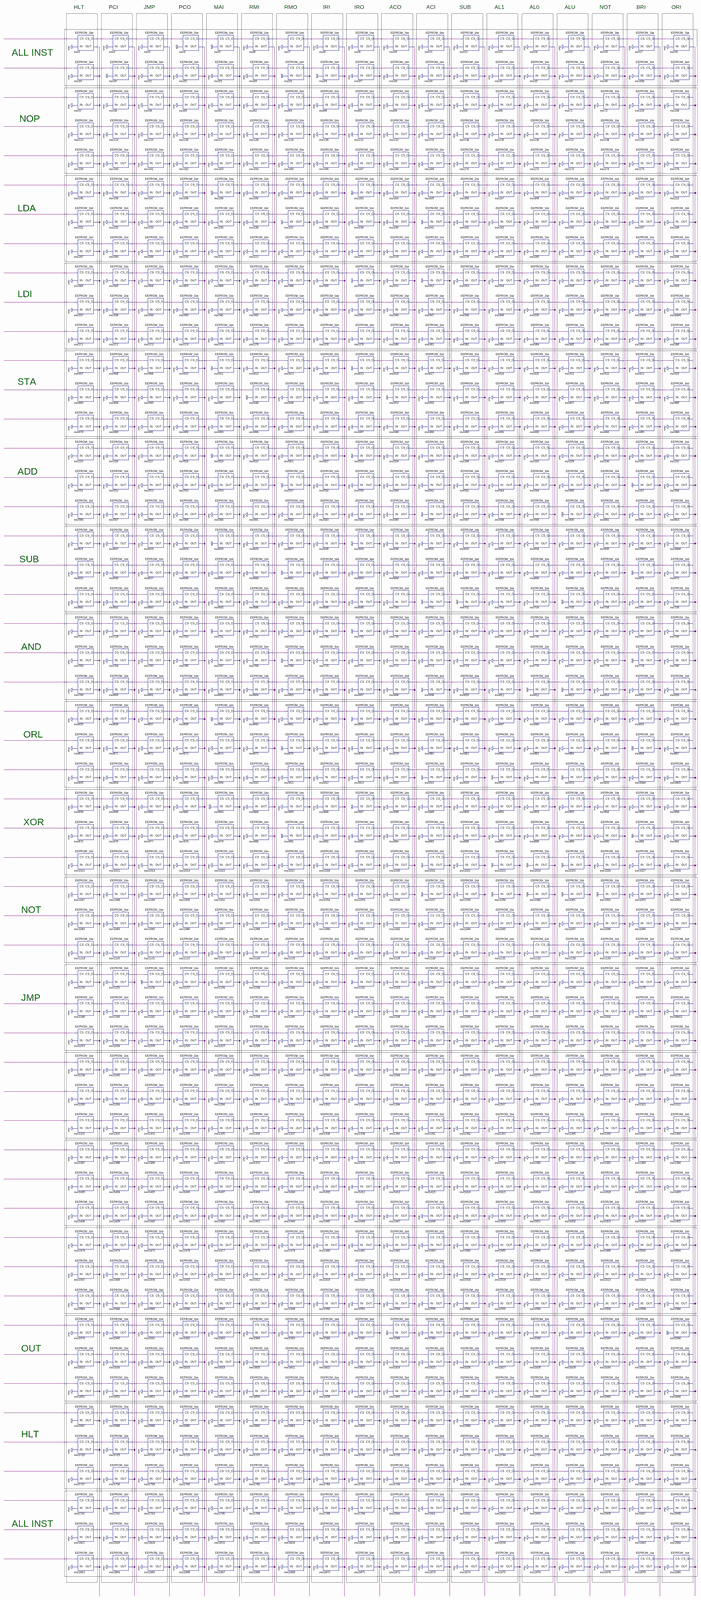
[diagram p0: schematic sheet, whole]
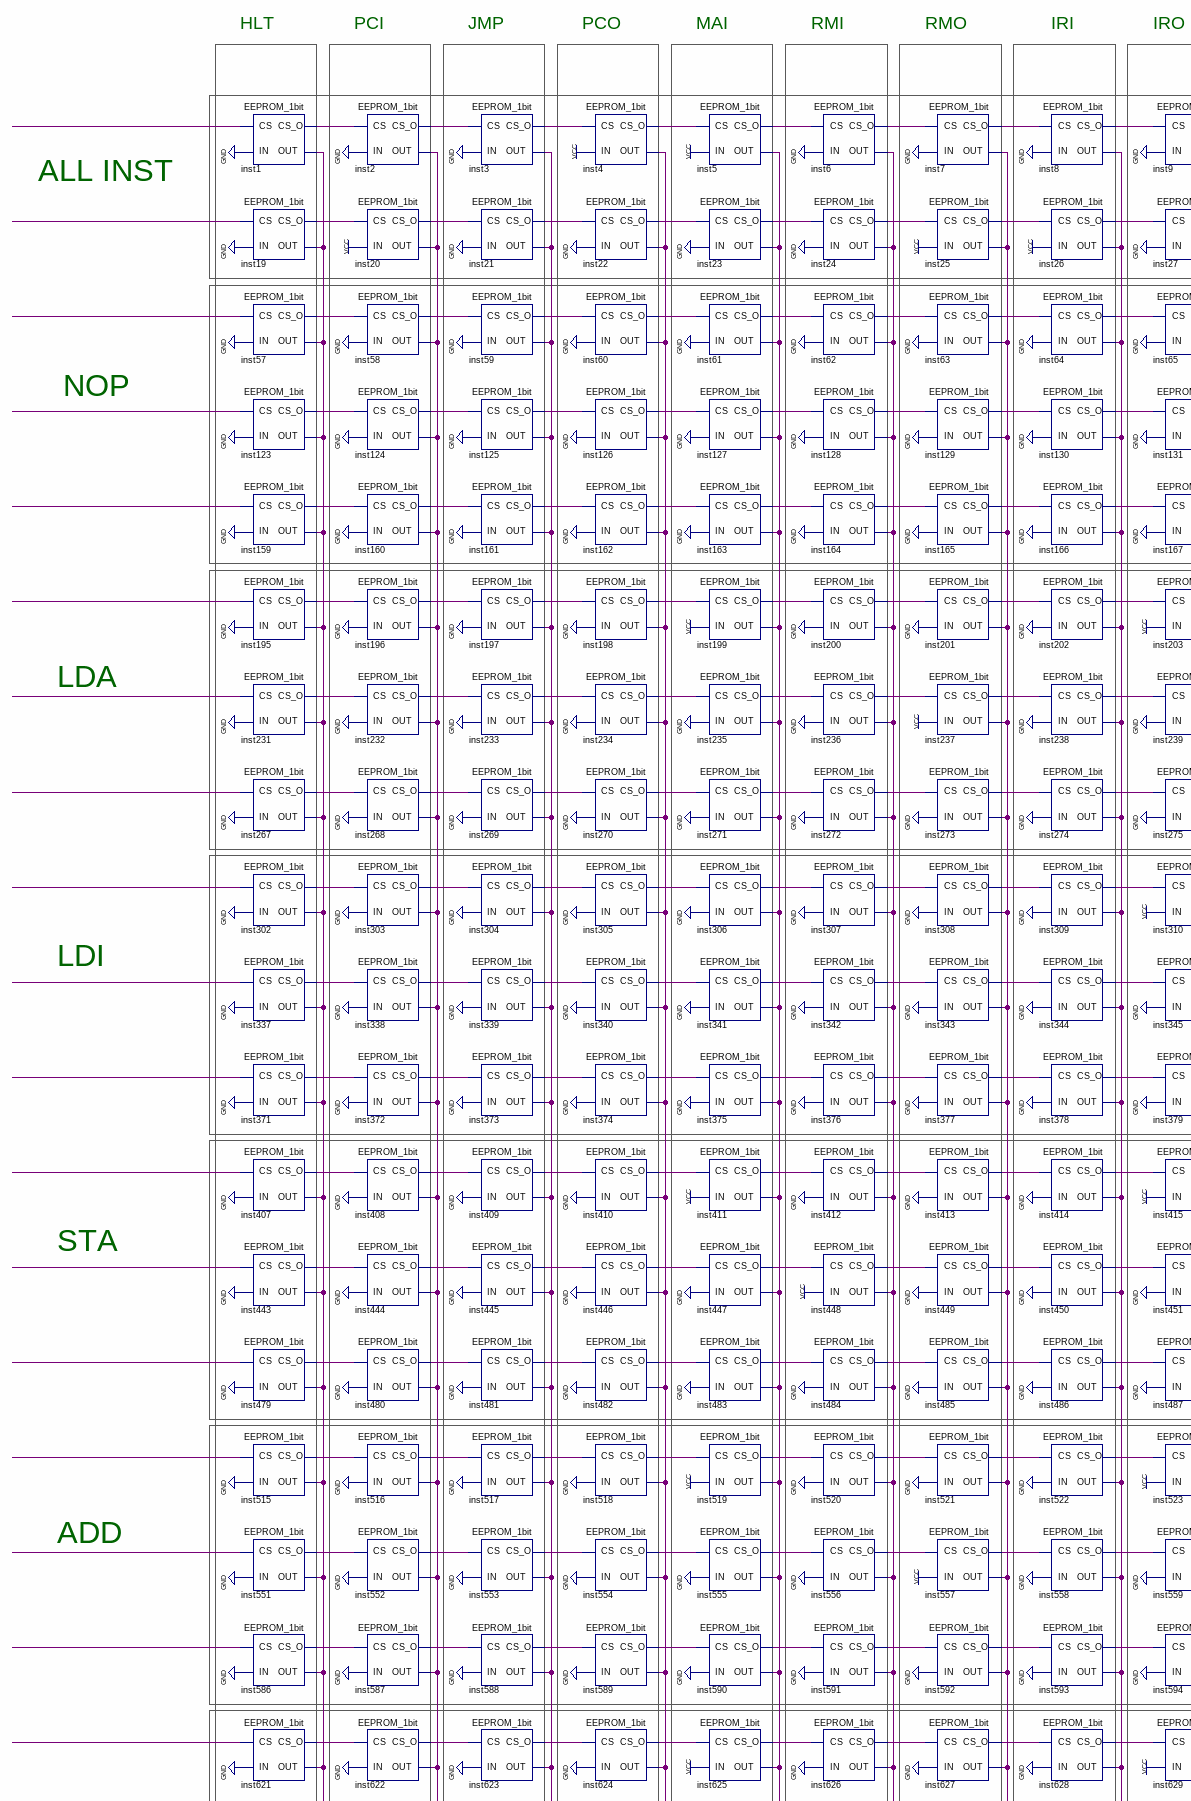
[diagram p1: schematic sheet, upper left part]
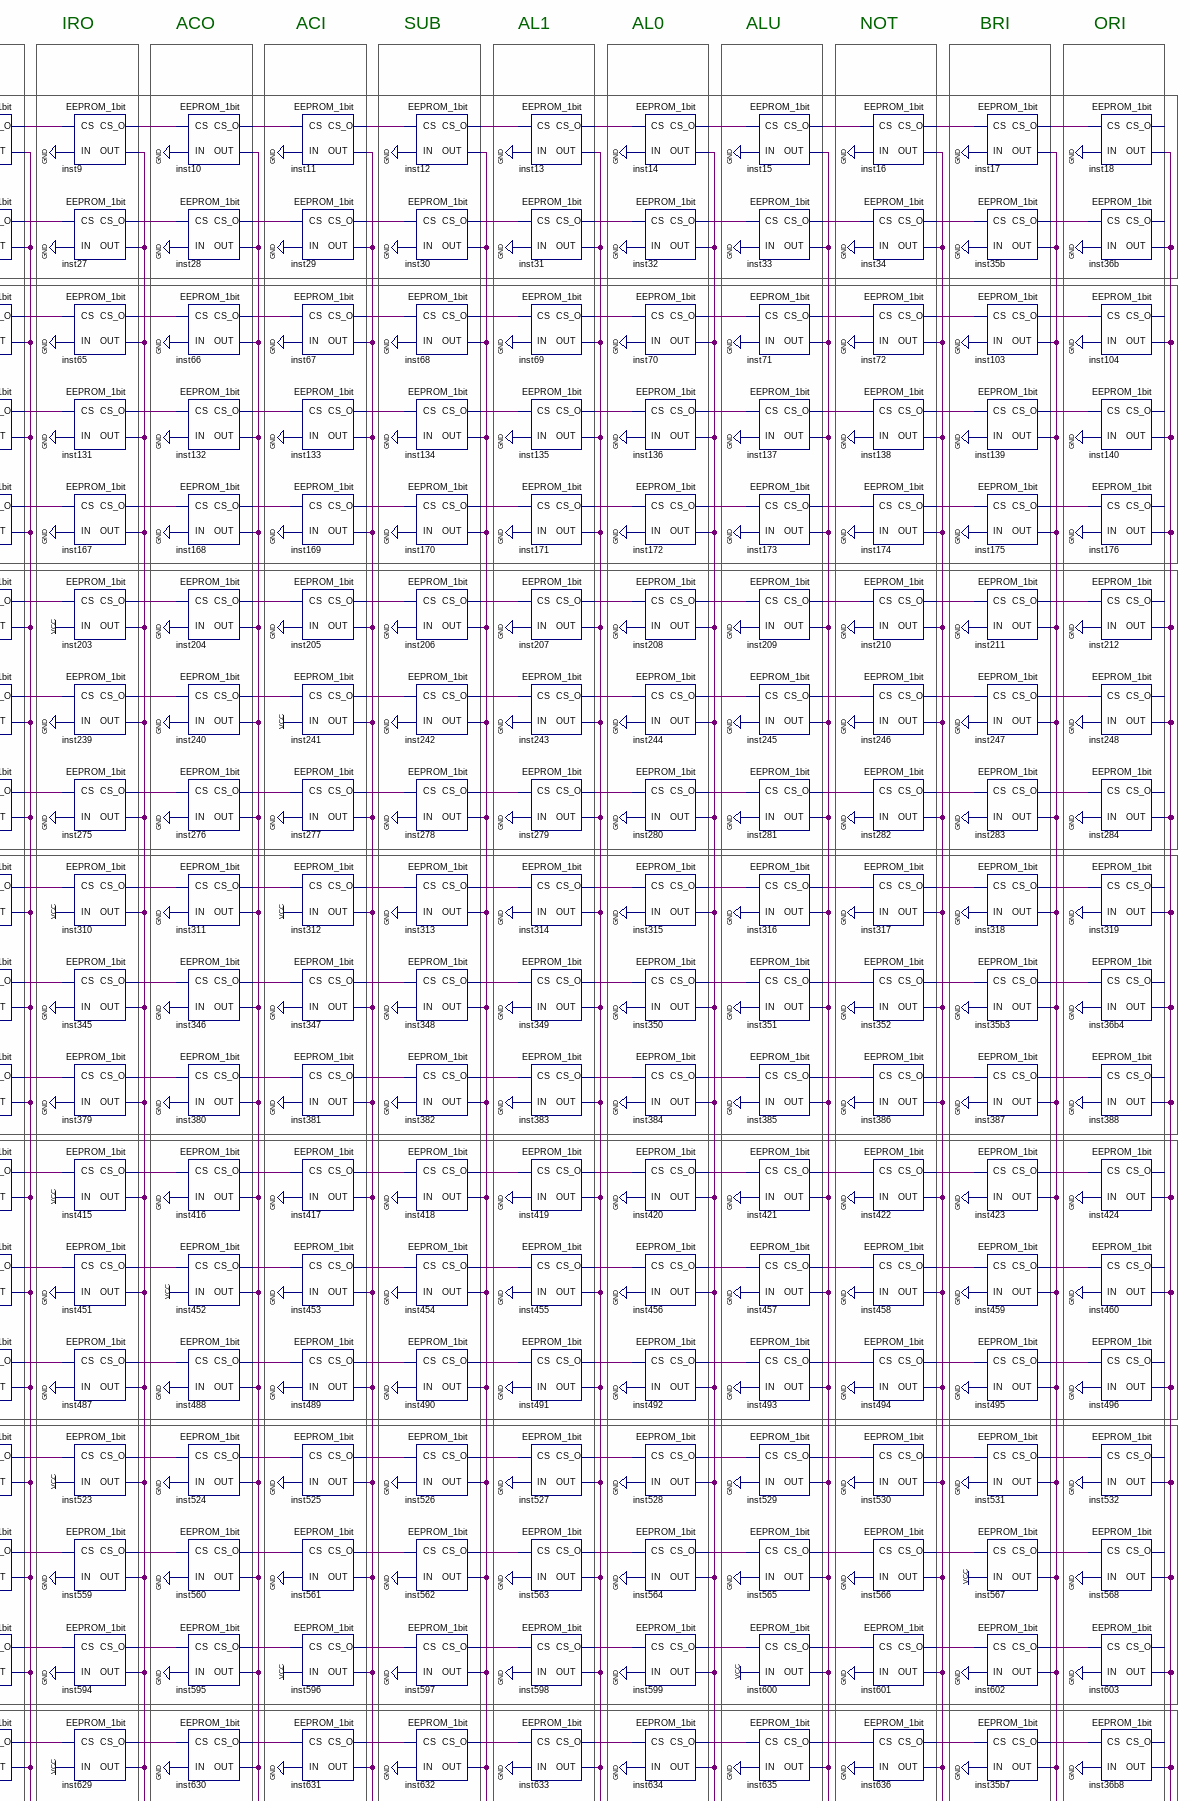
[diagram p2: schematic sheet, upper right part]
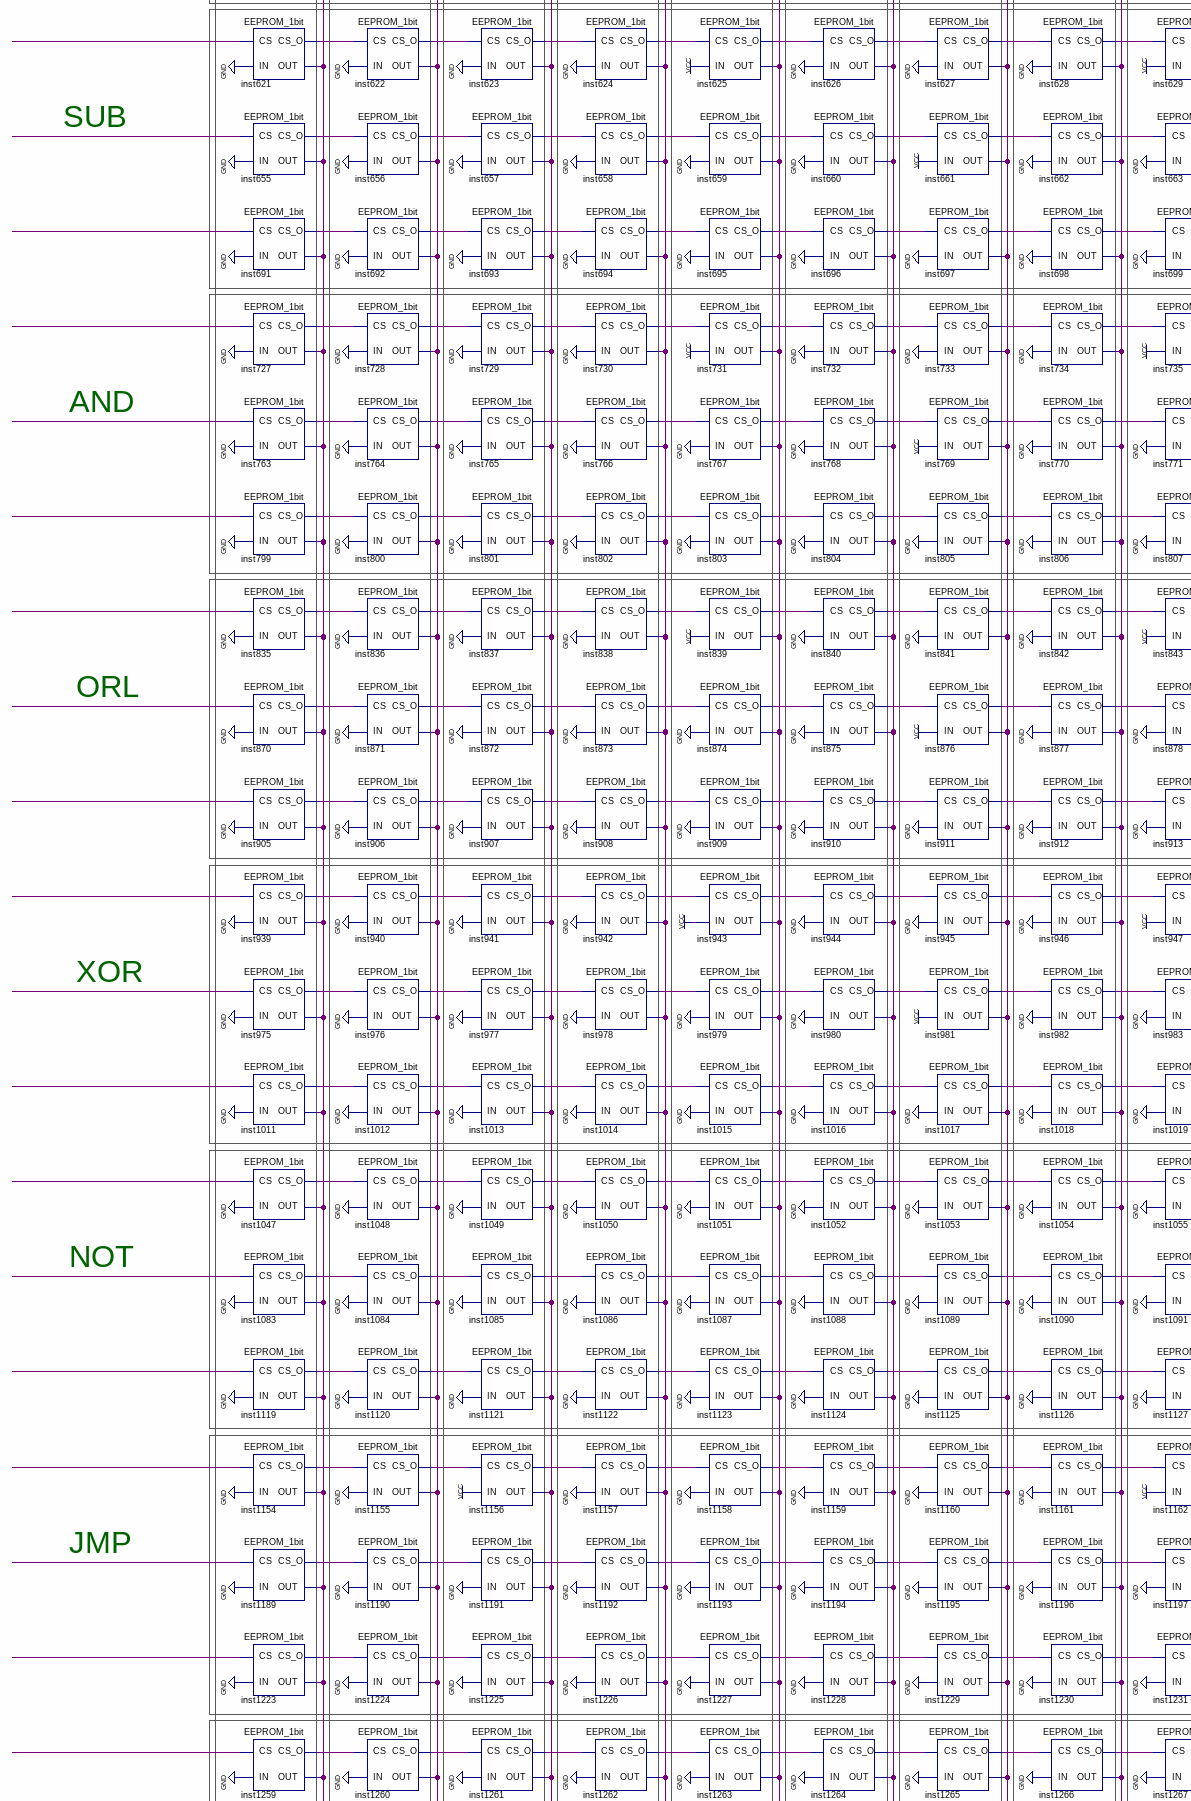
[diagram p3: schematic sheet, middle left part]
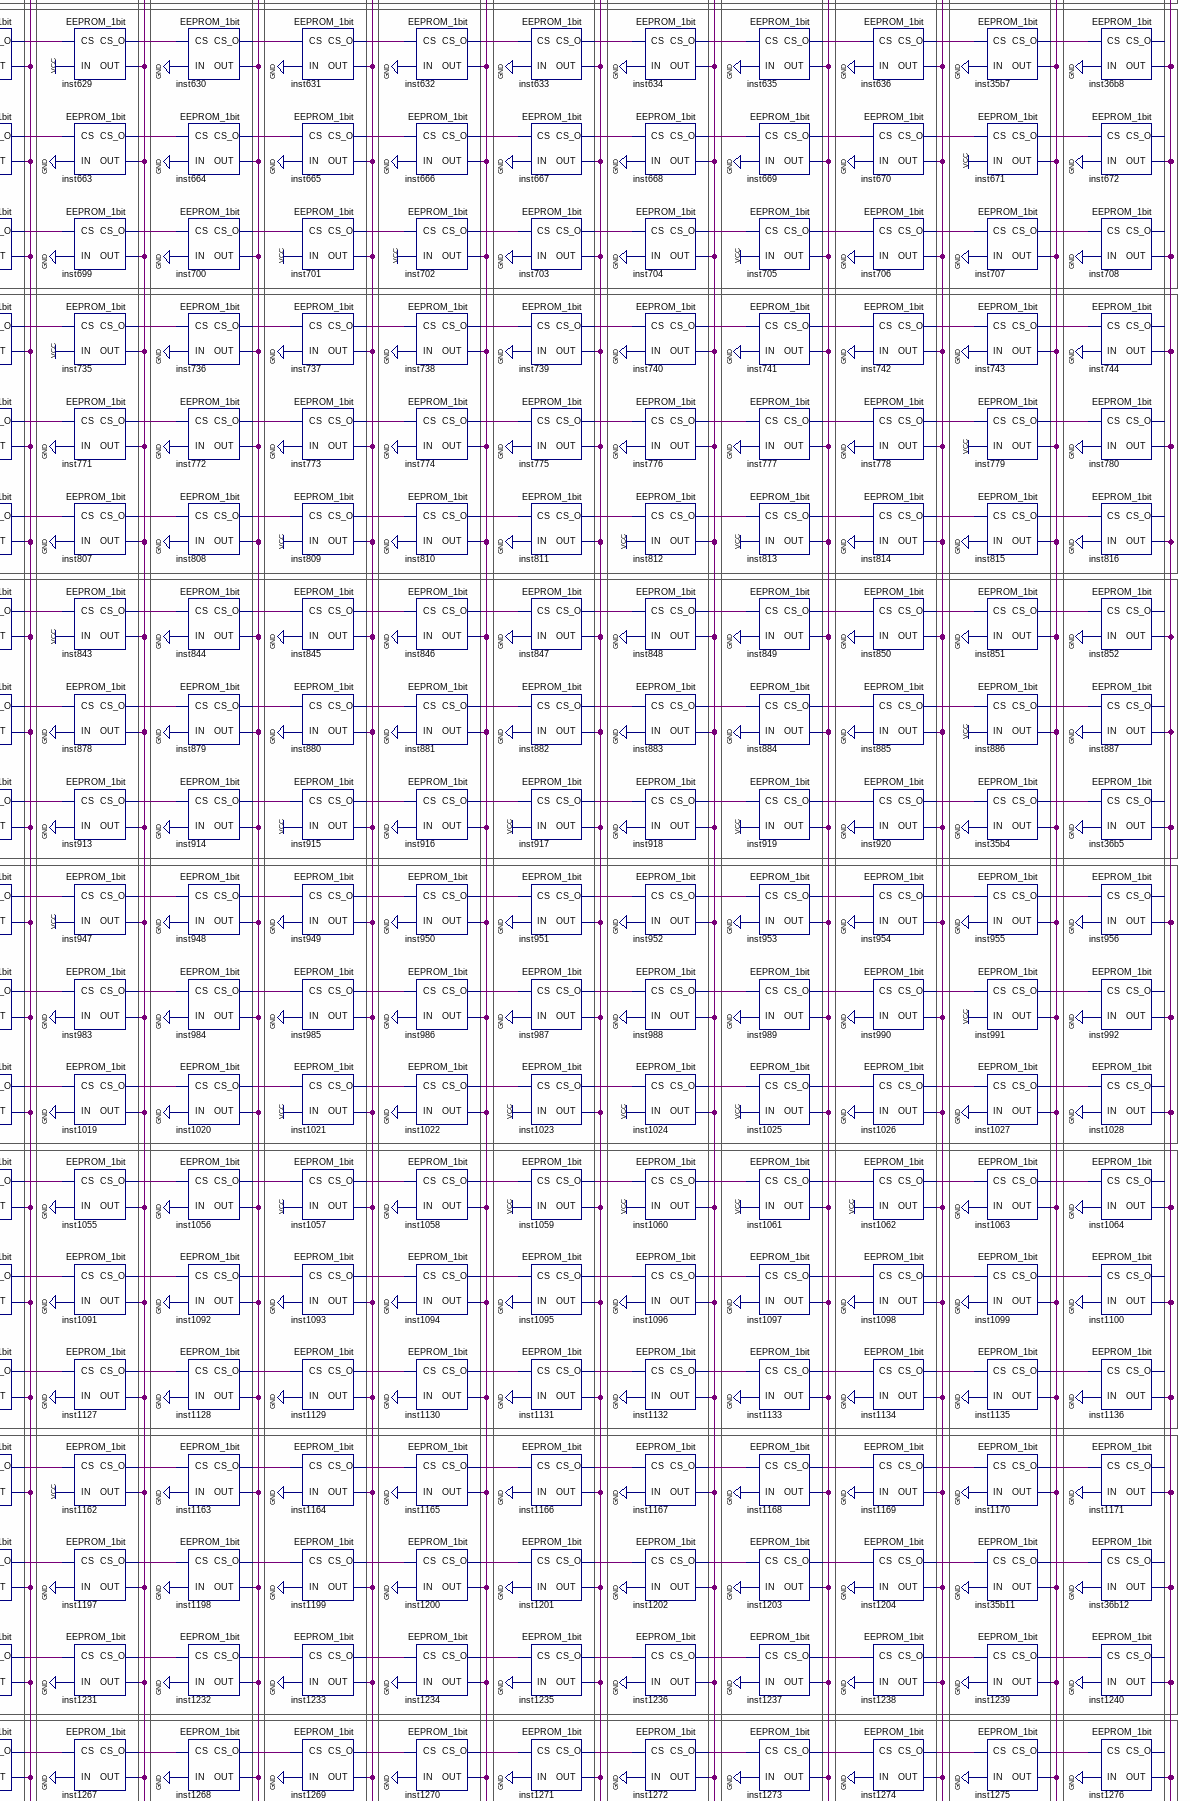
[diagram p4: schematic sheet, middle right part]
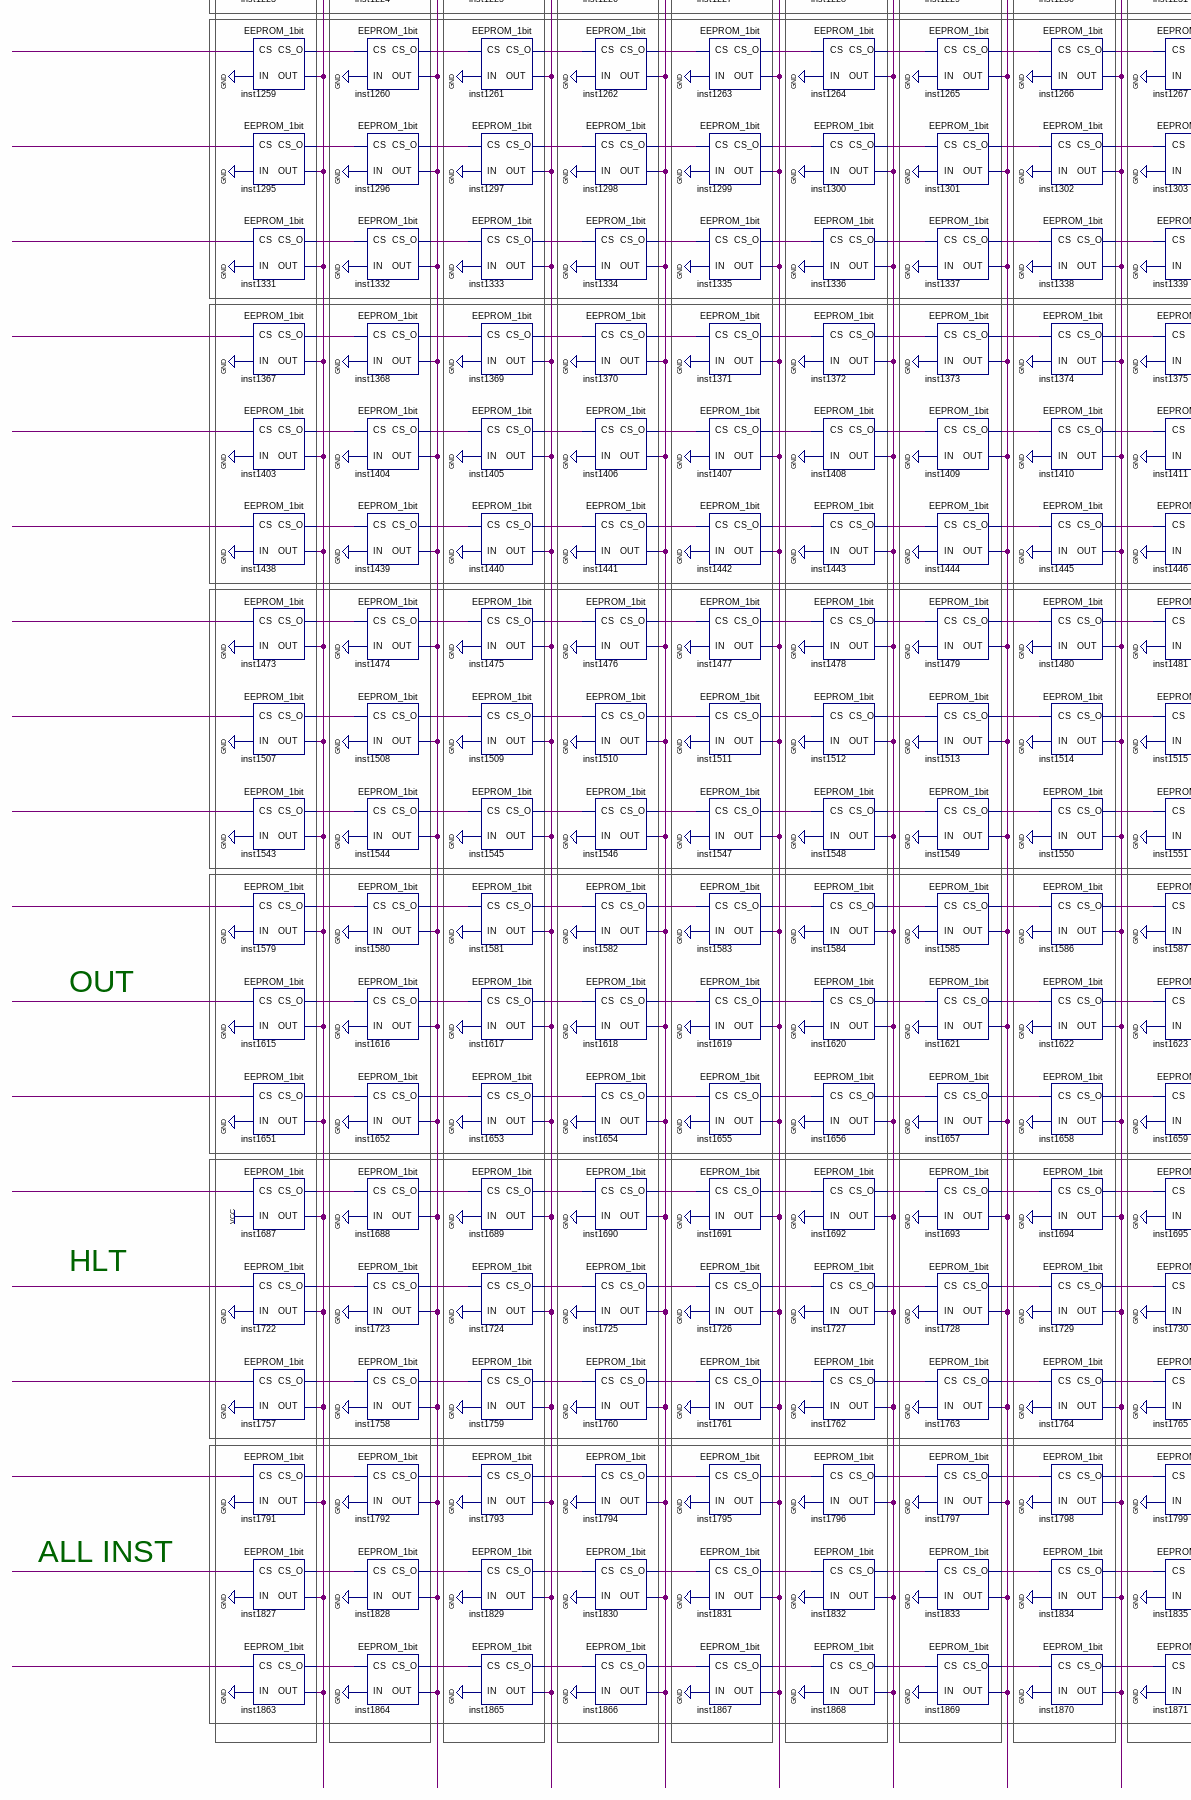
[diagram p5: schematic sheet, lower left part]
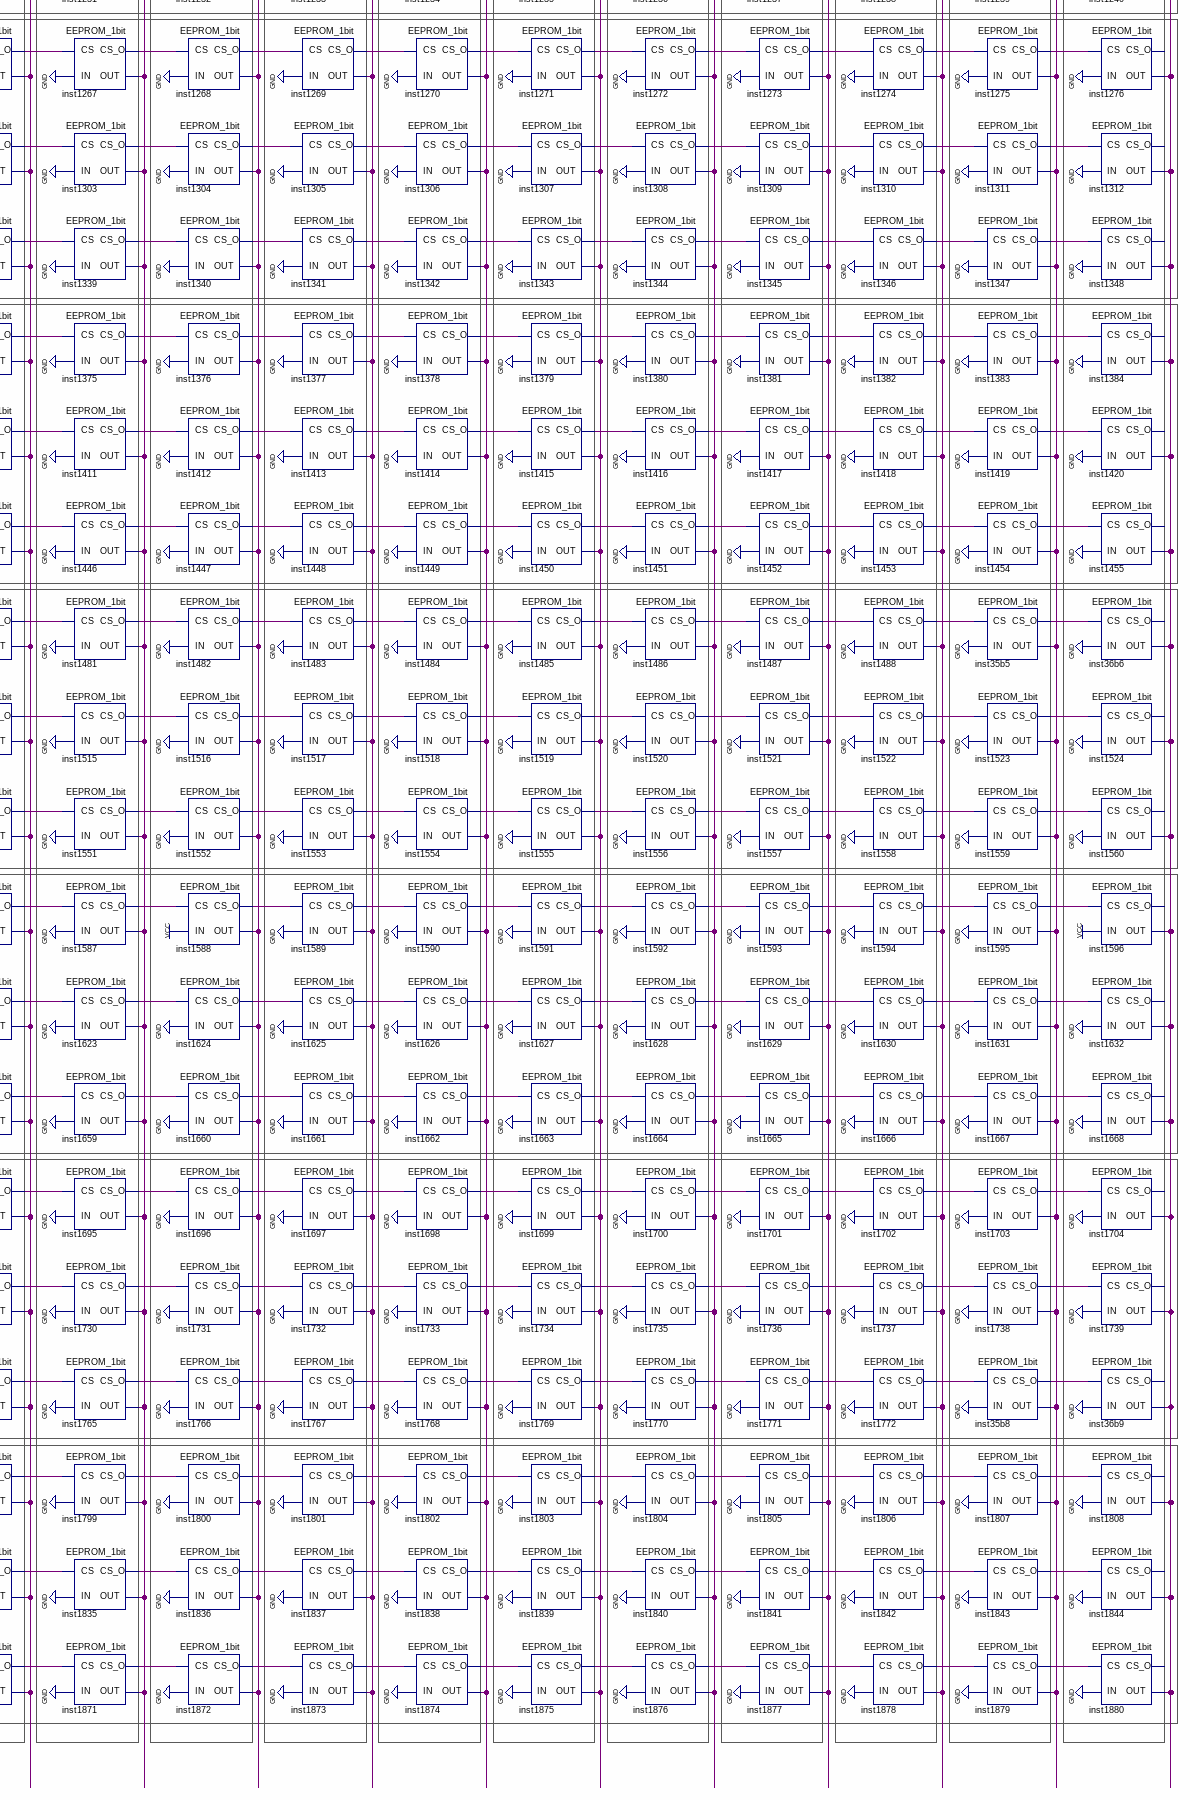
[diagram p6: schematic sheet, lower right part]
// Quartus schematic EEPROM_53x18_EMPTY.bdf as structural Verilog: 954 symbols, 0 pins
module EEPROM_53x18_EMPTY (
);

  wire inst1_cs_o, inst1_out, inst2_cs_o, inst2_out, inst3_cs_o, inst3_out, inst4_cs_o, inst4_out,
       inst5_cs_o, inst5_out, inst6_cs_o, inst6_out, inst7_cs_o, inst7_out, inst8_cs_o, inst8_out,
       inst9_cs_o, inst9_out, inst10_cs_o, inst10_out, inst11_cs_o, inst11_out, inst12_cs_o, inst12_out,
       inst13_cs_o, inst13_out, inst14_cs_o, inst14_out, inst15_cs_o, inst15_out, inst16_cs_o, inst16_out,
       inst17_cs_o, inst17_out, inst18_out, inst19_cs_o, inst20_cs_o, inst21_cs_o, inst22_cs_o, inst23_cs_o,
       inst24_cs_o, inst25_cs_o, inst26_cs_o, inst27_cs_o, inst28_cs_o, inst29_cs_o, inst30_cs_o,
       inst31_cs_o, inst32_cs_o, inst33_cs_o, inst34_cs_o, inst35b3_cs_o, inst35b4_cs_o, inst35b5_cs_o,
       inst35b7_cs_o, inst35b8_cs_o, inst35b11_cs_o, inst35b_cs_o, inst57_cs_o, inst58_cs_o, inst59_cs_o,
       inst60_cs_o, inst61_cs_o, inst62_cs_o, inst63_cs_o, inst64_cs_o, inst65_cs_o, inst66_cs_o,
       inst67_cs_o, inst68_cs_o, inst69_cs_o, inst70_cs_o, inst71_cs_o, inst72_cs_o, inst103_cs_o,
       inst123_cs_o, inst124_cs_o, inst125_cs_o, inst126_cs_o, inst127_cs_o, inst128_cs_o, inst129_cs_o,
       inst130_cs_o, inst131_cs_o, inst132_cs_o, inst133_cs_o, inst134_cs_o, inst135_cs_o, inst136_cs_o,
       inst137_cs_o, inst138_cs_o, inst139_cs_o, inst159_cs_o, inst160_cs_o, inst161_cs_o, inst162_cs_o,
       inst163_cs_o, inst164_cs_o, inst165_cs_o, inst166_cs_o, inst167_cs_o, inst168_cs_o, inst169_cs_o,
       inst170_cs_o, inst171_cs_o, inst172_cs_o, inst173_cs_o, inst174_cs_o, inst175_cs_o, inst195_cs_o,
       inst196_cs_o, inst197_cs_o, inst198_cs_o, inst199_cs_o, inst200_cs_o, inst201_cs_o, inst202_cs_o,
       inst203_cs_o, inst204_cs_o, inst205_cs_o, inst206_cs_o, inst207_cs_o, inst208_cs_o, inst209_cs_o,
       inst210_cs_o, inst211_cs_o, inst231_cs_o, inst232_cs_o, inst233_cs_o, inst234_cs_o, inst235_cs_o,
       inst236_cs_o, inst237_cs_o, inst238_cs_o, inst239_cs_o, inst240_cs_o, inst241_cs_o, inst242_cs_o,
       inst243_cs_o, inst244_cs_o, inst245_cs_o, inst246_cs_o, inst247_cs_o, inst267_cs_o, inst268_cs_o,
       inst269_cs_o, inst270_cs_o, inst271_cs_o, inst272_cs_o, inst273_cs_o, inst274_cs_o, inst275_cs_o,
       inst276_cs_o, inst277_cs_o, inst278_cs_o, inst279_cs_o, inst280_cs_o, inst281_cs_o, inst282_cs_o,
       inst283_cs_o, inst302_cs_o, inst303_cs_o, inst304_cs_o, inst305_cs_o, inst306_cs_o, inst307_cs_o,
       inst308_cs_o, inst309_cs_o, inst310_cs_o, inst311_cs_o, inst312_cs_o, inst313_cs_o, inst314_cs_o,
       inst315_cs_o, inst316_cs_o, inst317_cs_o, inst318_cs_o, inst337_cs_o, inst338_cs_o, inst339_cs_o,
       inst340_cs_o, inst341_cs_o, inst342_cs_o, inst343_cs_o, inst344_cs_o, inst345_cs_o, inst346_cs_o,
       inst347_cs_o, inst348_cs_o, inst349_cs_o, inst350_cs_o, inst351_cs_o, inst352_cs_o, inst371_cs_o,
       inst372_cs_o, inst373_cs_o, inst374_cs_o, inst375_cs_o, inst376_cs_o, inst377_cs_o, inst378_cs_o,
       inst379_cs_o, inst380_cs_o, inst381_cs_o, inst382_cs_o, inst383_cs_o, inst384_cs_o, inst385_cs_o,
       inst386_cs_o, inst387_cs_o, inst407_cs_o, inst408_cs_o, inst409_cs_o, inst410_cs_o, inst411_cs_o,
       inst412_cs_o, inst413_cs_o, inst414_cs_o, inst415_cs_o, inst416_cs_o, inst417_cs_o, inst418_cs_o,
       inst419_cs_o, inst420_cs_o, inst421_cs_o, inst422_cs_o, inst423_cs_o, inst443_cs_o, inst444_cs_o,
       inst445_cs_o, inst446_cs_o, inst447_cs_o, inst448_cs_o, inst449_cs_o, inst450_cs_o, inst451_cs_o,
       inst452_cs_o, inst453_cs_o, inst454_cs_o, inst455_cs_o, inst456_cs_o, inst457_cs_o, inst458_cs_o,
       inst459_cs_o, inst479_cs_o, inst480_cs_o, inst481_cs_o, inst482_cs_o, inst483_cs_o, inst484_cs_o,
       inst485_cs_o, inst486_cs_o, inst487_cs_o, inst488_cs_o, inst489_cs_o, inst490_cs_o, inst491_cs_o,
       inst492_cs_o, inst493_cs_o, inst494_cs_o, inst495_cs_o, inst515_cs_o, inst516_cs_o, inst517_cs_o,
       inst518_cs_o, inst519_cs_o, inst520_cs_o, inst521_cs_o, inst522_cs_o, inst523_cs_o, inst524_cs_o,
       inst525_cs_o, inst526_cs_o, inst527_cs_o, inst528_cs_o, inst529_cs_o, inst530_cs_o, inst531_cs_o,
       inst551_cs_o, inst552_cs_o, inst553_cs_o, inst554_cs_o, inst555_cs_o, inst556_cs_o, inst557_cs_o,
       inst558_cs_o, inst559_cs_o, inst560_cs_o, inst561_cs_o, inst562_cs_o, inst563_cs_o, inst564_cs_o,
       inst565_cs_o, inst566_cs_o, inst567_cs_o, inst586_cs_o, inst587_cs_o, inst588_cs_o, inst589_cs_o,
       inst590_cs_o, inst591_cs_o, inst592_cs_o, inst593_cs_o, inst594_cs_o, inst595_cs_o, inst596_cs_o,
       inst597_cs_o, inst598_cs_o, inst599_cs_o, inst600_cs_o, inst601_cs_o, inst602_cs_o, inst621_cs_o,
       inst622_cs_o, inst623_cs_o, inst624_cs_o, inst625_cs_o, inst626_cs_o, inst627_cs_o, inst628_cs_o,
       inst629_cs_o, inst630_cs_o, inst631_cs_o, inst632_cs_o, inst633_cs_o, inst634_cs_o, inst635_cs_o,
       inst636_cs_o, inst655_cs_o, inst656_cs_o, inst657_cs_o, inst658_cs_o, inst659_cs_o, inst660_cs_o,
       inst661_cs_o, inst662_cs_o, inst663_cs_o, inst664_cs_o, inst665_cs_o, inst666_cs_o, inst667_cs_o,
       inst668_cs_o, inst669_cs_o, inst670_cs_o, inst671_cs_o, inst691_cs_o, inst692_cs_o, inst693_cs_o,
       inst694_cs_o, inst695_cs_o, inst696_cs_o, inst697_cs_o, inst698_cs_o, inst699_cs_o, inst700_cs_o,
       inst701_cs_o, inst702_cs_o, inst703_cs_o, inst704_cs_o, inst705_cs_o, inst706_cs_o, inst707_cs_o,
       inst727_cs_o, inst728_cs_o, inst729_cs_o, inst730_cs_o, inst731_cs_o, inst732_cs_o, inst733_cs_o,
       inst734_cs_o, inst735_cs_o, inst736_cs_o, inst737_cs_o, inst738_cs_o, inst739_cs_o, inst740_cs_o,
       inst741_cs_o, inst742_cs_o, inst743_cs_o, inst763_cs_o, inst764_cs_o, inst765_cs_o, inst766_cs_o,
       inst767_cs_o, inst768_cs_o, inst769_cs_o, inst770_cs_o, inst771_cs_o, inst772_cs_o, inst773_cs_o,
       inst774_cs_o, inst775_cs_o, inst776_cs_o, inst777_cs_o, inst778_cs_o, inst779_cs_o, inst799_cs_o,
       inst800_cs_o, inst801_cs_o, inst802_cs_o, inst803_cs_o, inst804_cs_o, inst805_cs_o, inst806_cs_o,
       inst807_cs_o, inst808_cs_o, inst809_cs_o, inst810_cs_o, inst811_cs_o, inst812_cs_o, inst813_cs_o,
       inst814_cs_o, inst815_cs_o, inst835_cs_o, inst836_cs_o, inst837_cs_o, inst838_cs_o, inst839_cs_o,
       inst840_cs_o, inst841_cs_o, inst842_cs_o, inst843_cs_o, inst844_cs_o, inst845_cs_o, inst846_cs_o,
       inst847_cs_o, inst848_cs_o, inst849_cs_o, inst850_cs_o, inst851_cs_o, inst870_cs_o, inst871_cs_o,
       inst872_cs_o, inst873_cs_o, inst874_cs_o, inst875_cs_o, inst876_cs_o, inst877_cs_o, inst878_cs_o,
       inst879_cs_o, inst880_cs_o, inst881_cs_o, inst882_cs_o, inst883_cs_o, inst884_cs_o, inst885_cs_o,
       inst886_cs_o, inst905_cs_o, inst906_cs_o, inst907_cs_o, inst908_cs_o, inst909_cs_o, inst910_cs_o,
       inst911_cs_o, inst912_cs_o, inst913_cs_o, inst914_cs_o, inst915_cs_o, inst916_cs_o, inst917_cs_o,
       inst918_cs_o, inst919_cs_o, inst920_cs_o, inst939_cs_o, inst940_cs_o, inst941_cs_o, inst942_cs_o,
       inst943_cs_o, inst944_cs_o, inst945_cs_o, inst946_cs_o, inst947_cs_o, inst948_cs_o, inst949_cs_o,
       inst950_cs_o, inst951_cs_o, inst952_cs_o, inst953_cs_o, inst954_cs_o, inst955_cs_o, inst975_cs_o,
       inst976_cs_o, inst977_cs_o, inst978_cs_o, inst979_cs_o, inst980_cs_o, inst981_cs_o, inst982_cs_o,
       inst983_cs_o, inst984_cs_o, inst985_cs_o, inst986_cs_o, inst987_cs_o, inst988_cs_o, inst989_cs_o,
       inst990_cs_o, inst991_cs_o, inst1011_cs_o, inst1012_cs_o, inst1013_cs_o, inst1014_cs_o, inst1015_cs_o,
       inst1016_cs_o, inst1017_cs_o, inst1018_cs_o, inst1019_cs_o, inst1020_cs_o, inst1021_cs_o,
       inst1022_cs_o, inst1023_cs_o, inst1024_cs_o, inst1025_cs_o, inst1026_cs_o, inst1027_cs_o,
       inst1047_cs_o, inst1048_cs_o, inst1049_cs_o, inst1050_cs_o, inst1051_cs_o, inst1052_cs_o,
       inst1053_cs_o, inst1054_cs_o, inst1055_cs_o, inst1056_cs_o, inst1057_cs_o, inst1058_cs_o,
       inst1059_cs_o, inst1060_cs_o, inst1061_cs_o, inst1062_cs_o, inst1063_cs_o, inst1083_cs_o,
       inst1084_cs_o, inst1085_cs_o, inst1086_cs_o, inst1087_cs_o, inst1088_cs_o, inst1089_cs_o,
       inst1090_cs_o, inst1091_cs_o, inst1092_cs_o, inst1093_cs_o, inst1094_cs_o, inst1095_cs_o,
       inst1096_cs_o, inst1097_cs_o, inst1098_cs_o, inst1099_cs_o, inst1119_cs_o, inst1120_cs_o,
       inst1121_cs_o, inst1122_cs_o, inst1123_cs_o, inst1124_cs_o, inst1125_cs_o, inst1126_cs_o,
       inst1127_cs_o, inst1128_cs_o, inst1129_cs_o, inst1130_cs_o, inst1131_cs_o, inst1132_cs_o,
       inst1133_cs_o, inst1134_cs_o, inst1135_cs_o, inst1154_cs_o, inst1155_cs_o, inst1156_cs_o,
       inst1157_cs_o, inst1158_cs_o, inst1159_cs_o, inst1160_cs_o, inst1161_cs_o, inst1162_cs_o,
       inst1163_cs_o, inst1164_cs_o, inst1165_cs_o, inst1166_cs_o, inst1167_cs_o, inst1168_cs_o,
       inst1169_cs_o, inst1170_cs_o, inst1189_cs_o, inst1190_cs_o, inst1191_cs_o, inst1192_cs_o,
       inst1193_cs_o, inst1194_cs_o, inst1195_cs_o, inst1196_cs_o, inst1197_cs_o, inst1198_cs_o,
       inst1199_cs_o, inst1200_cs_o, inst1201_cs_o, inst1202_cs_o, inst1203_cs_o, inst1204_cs_o,
       inst1223_cs_o, inst1224_cs_o, inst1225_cs_o, inst1226_cs_o, inst1227_cs_o, inst1228_cs_o,
       inst1229_cs_o, inst1230_cs_o, inst1231_cs_o, inst1232_cs_o, inst1233_cs_o, inst1234_cs_o,
       inst1235_cs_o, inst1236_cs_o, inst1237_cs_o, inst1238_cs_o, inst1239_cs_o, inst1259_cs_o,
       inst1260_cs_o, inst1261_cs_o, inst1262_cs_o, inst1263_cs_o, inst1264_cs_o, inst1265_cs_o,
       inst1266_cs_o, inst1267_cs_o, inst1268_cs_o, inst1269_cs_o, inst1270_cs_o, inst1271_cs_o,
       inst1272_cs_o, inst1273_cs_o, inst1274_cs_o, inst1275_cs_o, inst1295_cs_o, inst1296_cs_o,
       inst1297_cs_o, inst1298_cs_o, inst1299_cs_o, inst1300_cs_o, inst1301_cs_o, inst1302_cs_o,
       inst1303_cs_o, inst1304_cs_o, inst1305_cs_o, inst1306_cs_o, inst1307_cs_o, inst1308_cs_o,
       inst1309_cs_o, inst1310_cs_o, inst1311_cs_o, inst1331_cs_o, inst1332_cs_o, inst1333_cs_o,
       inst1334_cs_o, inst1335_cs_o, inst1336_cs_o, inst1337_cs_o, inst1338_cs_o, inst1339_cs_o,
       inst1340_cs_o, inst1341_cs_o, inst1342_cs_o, inst1343_cs_o, inst1344_cs_o, inst1345_cs_o,
       inst1346_cs_o, inst1347_cs_o, inst1367_cs_o, inst1368_cs_o, inst1369_cs_o, inst1370_cs_o,
       inst1371_cs_o, inst1372_cs_o, inst1373_cs_o, inst1374_cs_o, inst1375_cs_o, inst1376_cs_o,
       inst1377_cs_o, inst1378_cs_o, inst1379_cs_o, inst1380_cs_o, inst1381_cs_o, inst1382_cs_o,
       inst1383_cs_o, inst1403_cs_o, inst1404_cs_o, inst1405_cs_o, inst1406_cs_o, inst1407_cs_o,
       inst1408_cs_o, inst1409_cs_o, inst1410_cs_o, inst1411_cs_o, inst1412_cs_o, inst1413_cs_o,
       inst1414_cs_o, inst1415_cs_o, inst1416_cs_o, inst1417_cs_o, inst1418_cs_o, inst1419_cs_o,
       inst1438_cs_o, inst1439_cs_o, inst1440_cs_o, inst1441_cs_o, inst1442_cs_o, inst1443_cs_o,
       inst1444_cs_o, inst1445_cs_o, inst1446_cs_o, inst1447_cs_o, inst1448_cs_o, inst1449_cs_o,
       inst1450_cs_o, inst1451_cs_o, inst1452_cs_o, inst1453_cs_o, inst1454_cs_o, inst1473_cs_o,
       inst1474_cs_o, inst1475_cs_o, inst1476_cs_o, inst1477_cs_o, inst1478_cs_o, inst1479_cs_o,
       inst1480_cs_o, inst1481_cs_o, inst1482_cs_o, inst1483_cs_o, inst1484_cs_o, inst1485_cs_o,
       inst1486_cs_o, inst1487_cs_o, inst1488_cs_o, inst1507_cs_o, inst1508_cs_o, inst1509_cs_o,
       inst1510_cs_o, inst1511_cs_o, inst1512_cs_o, inst1513_cs_o, inst1514_cs_o, inst1515_cs_o,
       inst1516_cs_o, inst1517_cs_o, inst1518_cs_o, inst1519_cs_o, inst1520_cs_o, inst1521_cs_o,
       inst1522_cs_o, inst1523_cs_o, inst1543_cs_o, inst1544_cs_o, inst1545_cs_o, inst1546_cs_o,
       inst1547_cs_o, inst1548_cs_o, inst1549_cs_o, inst1550_cs_o, inst1551_cs_o, inst1552_cs_o,
       inst1553_cs_o, inst1554_cs_o, inst1555_cs_o, inst1556_cs_o, inst1557_cs_o, inst1558_cs_o,
       inst1559_cs_o, inst1579_cs_o, inst1580_cs_o, inst1581_cs_o, inst1582_cs_o, inst1583_cs_o,
       inst1584_cs_o, inst1585_cs_o, inst1586_cs_o, inst1587_cs_o, inst1588_cs_o, inst1589_cs_o,
       inst1590_cs_o, inst1591_cs_o, inst1592_cs_o, inst1593_cs_o, inst1594_cs_o, inst1595_cs_o,
       inst1615_cs_o, inst1616_cs_o, inst1617_cs_o, inst1618_cs_o, inst1619_cs_o, inst1620_cs_o,
       inst1621_cs_o, inst1622_cs_o, inst1623_cs_o, inst1624_cs_o, inst1625_cs_o, inst1626_cs_o,
       inst1627_cs_o, inst1628_cs_o, inst1629_cs_o, inst1630_cs_o, inst1631_cs_o, inst1651_cs_o,
       inst1652_cs_o, inst1653_cs_o, inst1654_cs_o, inst1655_cs_o, inst1656_cs_o, inst1657_cs_o,
       inst1658_cs_o, inst1659_cs_o, inst1660_cs_o, inst1661_cs_o, inst1662_cs_o, inst1663_cs_o,
       inst1664_cs_o, inst1665_cs_o, inst1666_cs_o, inst1667_cs_o, inst1687_cs_o, inst1688_cs_o,
       inst1689_cs_o, inst1690_cs_o, inst1691_cs_o, inst1692_cs_o, inst1693_cs_o, inst1694_cs_o,
       inst1695_cs_o, inst1696_cs_o, inst1697_cs_o, inst1698_cs_o, inst1699_cs_o, inst1700_cs_o,
       inst1701_cs_o, inst1702_cs_o, inst1703_cs_o, inst1722_cs_o, inst1723_cs_o, inst1724_cs_o,
       inst1725_cs_o, inst1726_cs_o, inst1727_cs_o, inst1728_cs_o, inst1729_cs_o, inst1730_cs_o,
       inst1731_cs_o, inst1732_cs_o, inst1733_cs_o, inst1734_cs_o, inst1735_cs_o, inst1736_cs_o,
       inst1737_cs_o, inst1738_cs_o, inst1757_cs_o, inst1758_cs_o, inst1759_cs_o, inst1760_cs_o,
       inst1761_cs_o, inst1762_cs_o, inst1763_cs_o, inst1764_cs_o, inst1765_cs_o, inst1766_cs_o,
       inst1767_cs_o, inst1768_cs_o, inst1769_cs_o, inst1770_cs_o, inst1771_cs_o, inst1772_cs_o,
       inst1791_cs_o, inst1792_cs_o, inst1793_cs_o, inst1794_cs_o, inst1795_cs_o, inst1796_cs_o,
       inst1797_cs_o, inst1798_cs_o, inst1799_cs_o, inst1800_cs_o, inst1801_cs_o, inst1802_cs_o,
       inst1803_cs_o, inst1804_cs_o, inst1805_cs_o, inst1806_cs_o, inst1807_cs_o, inst1827_cs_o,
       inst1828_cs_o, inst1829_cs_o, inst1830_cs_o, inst1831_cs_o, inst1832_cs_o, inst1833_cs_o,
       inst1834_cs_o, inst1835_cs_o, inst1836_cs_o, inst1837_cs_o, inst1838_cs_o, inst1839_cs_o,
       inst1840_cs_o, inst1841_cs_o, inst1842_cs_o, inst1843_cs_o, inst1863_cs_o, inst1864_cs_o,
       inst1865_cs_o, inst1866_cs_o, inst1867_cs_o, inst1868_cs_o, inst1869_cs_o, inst1870_cs_o,
       inst1871_cs_o, inst1872_cs_o, inst1873_cs_o, inst1874_cs_o, inst1875_cs_o, inst1876_cs_o,
       inst1877_cs_o, inst1878_cs_o, inst1879_cs_o, undriven, undriven_2, undriven_3, undriven_4, undriven_5,
       undriven_6, undriven_7, undriven_8, undriven_9, undriven_10, undriven_11, undriven_12, undriven_13,
       undriven_14, undriven_15, undriven_16, undriven_17, undriven_18, undriven_19, undriven_20,
       undriven_21, undriven_22, undriven_23, undriven_24, undriven_25, undriven_26, undriven_27,
       undriven_28, undriven_29, undriven_30, undriven_31, undriven_32, undriven_33, undriven_34,
       undriven_35, undriven_36, undriven_37, undriven_38, undriven_39, undriven_40, undriven_41,
       undriven_42, undriven_43, undriven_44, undriven_45, undriven_46, undriven_47, undriven_48,
       undriven_49, undriven_50, undriven_51, undriven_52, undriven_53;

  EEPROM_1bit inst1 (.CS(undriven), .IN(1'b0), .CS_O(inst1_cs_o), .OUT(inst1_out));
  EEPROM_1bit inst19 (.CS(undriven_2), .IN(1'b0), .CS_O(inst19_cs_o), .OUT(inst1_out));
  EEPROM_1bit inst57 (.CS(undriven_3), .IN(1'b0), .CS_O(inst57_cs_o), .OUT(inst1_out));
  EEPROM_1bit inst123 (.CS(undriven_4), .IN(1'b0), .CS_O(inst123_cs_o), .OUT(inst1_out));
  EEPROM_1bit inst159 (.CS(undriven_5), .IN(1'b0), .CS_O(inst159_cs_o), .OUT(inst1_out));
  EEPROM_1bit inst195 (.CS(undriven_53), .IN(1'b0), .CS_O(inst195_cs_o), .OUT(inst1_out));
  EEPROM_1bit inst231 (.CS(undriven_6), .IN(1'b0), .CS_O(inst231_cs_o), .OUT(inst1_out));
  EEPROM_1bit inst267 (.CS(undriven_7), .IN(1'b0), .CS_O(inst267_cs_o), .OUT(inst1_out));
  EEPROM_1bit inst302 (.CS(undriven_8), .IN(1'b0), .CS_O(inst302_cs_o), .OUT(inst1_out));
  EEPROM_1bit inst337 (.CS(undriven_9), .IN(1'b0), .CS_O(inst337_cs_o), .OUT(inst1_out));
  EEPROM_1bit inst371 (.CS(undriven_10), .IN(1'b0), .CS_O(inst371_cs_o), .OUT(inst1_out));
  EEPROM_1bit inst407 (.CS(undriven_11), .IN(1'b0), .CS_O(inst407_cs_o), .OUT(inst1_out));
  EEPROM_1bit inst443 (.CS(undriven_12), .IN(1'b0), .CS_O(inst443_cs_o), .OUT(inst1_out));
  EEPROM_1bit inst479 (.CS(undriven_13), .IN(1'b0), .CS_O(inst479_cs_o), .OUT(inst1_out));
  EEPROM_1bit inst515 (.CS(undriven_14), .IN(1'b0), .CS_O(inst515_cs_o), .OUT(inst1_out));
  EEPROM_1bit inst551 (.CS(undriven_15), .IN(1'b0), .CS_O(inst551_cs_o), .OUT(inst1_out));
  EEPROM_1bit inst586 (.CS(undriven_16), .IN(1'b0), .CS_O(inst586_cs_o), .OUT(inst1_out));
  EEPROM_1bit inst621 (.CS(undriven_17), .IN(1'b0), .CS_O(inst621_cs_o), .OUT(inst1_out));
  EEPROM_1bit inst655 (.CS(undriven_18), .IN(1'b0), .CS_O(inst655_cs_o), .OUT(inst1_out));
  EEPROM_1bit inst691 (.CS(undriven_19), .IN(1'b0), .CS_O(inst691_cs_o), .OUT(inst1_out));
  EEPROM_1bit inst727 (.CS(undriven_20), .IN(1'b0), .CS_O(inst727_cs_o), .OUT(inst1_out));
  EEPROM_1bit inst763 (.CS(undriven_21), .IN(1'b0), .CS_O(inst763_cs_o), .OUT(inst1_out));
  EEPROM_1bit inst799 (.CS(undriven_22), .IN(1'b0), .CS_O(inst799_cs_o), .OUT(inst1_out));
  EEPROM_1bit inst835 (.CS(undriven_23), .IN(1'b0), .CS_O(inst835_cs_o), .OUT(inst1_out));
  EEPROM_1bit inst870 (.CS(undriven_24), .IN(1'b0), .CS_O(inst870_cs_o), .OUT(inst1_out));
  EEPROM_1bit inst905 (.CS(undriven_25), .IN(1'b0), .CS_O(inst905_cs_o), .OUT(inst1_out));
  EEPROM_1bit inst939 (.CS(undriven_26), .IN(1'b0), .CS_O(inst939_cs_o), .OUT(inst1_out));
  EEPROM_1bit inst975 (.CS(undriven_27), .IN(1'b0), .CS_O(inst975_cs_o), .OUT(inst1_out));
  EEPROM_1bit inst1011 (.CS(undriven_28), .IN(1'b0), .CS_O(inst1011_cs_o), .OUT(inst1_out));
  EEPROM_1bit inst1047 (.CS(undriven_29), .IN(1'b0), .CS_O(inst1047_cs_o), .OUT(inst1_out));
  EEPROM_1bit inst1083 (.CS(undriven_30), .IN(1'b0), .CS_O(inst1083_cs_o), .OUT(inst1_out));
  EEPROM_1bit inst1119 (.CS(undriven_31), .IN(1'b0), .CS_O(inst1119_cs_o), .OUT(inst1_out));
  EEPROM_1bit inst1154 (.CS(undriven_32), .IN(1'b0), .CS_O(inst1154_cs_o), .OUT(inst1_out));
  EEPROM_1bit inst1189 (.CS(undriven_33), .IN(1'b0), .CS_O(inst1189_cs_o), .OUT(inst1_out));
  EEPROM_1bit inst1223 (.CS(undriven_34), .IN(1'b0), .CS_O(inst1223_cs_o), .OUT(inst1_out));
  EEPROM_1bit inst1259 (.CS(undriven_35), .IN(1'b0), .CS_O(inst1259_cs_o), .OUT(inst1_out));
  EEPROM_1bit inst1295 (.CS(undriven_36), .IN(1'b0), .CS_O(inst1295_cs_o), .OUT(inst1_out));
  EEPROM_1bit inst1331 (.CS(undriven_37), .IN(1'b0), .CS_O(inst1331_cs_o), .OUT(inst1_out));
  EEPROM_1bit inst1367 (.CS(undriven_38), .IN(1'b0), .CS_O(inst1367_cs_o), .OUT(inst1_out));
  EEPROM_1bit inst1403 (.CS(undriven_39), .IN(1'b0), .CS_O(inst1403_cs_o), .OUT(inst1_out));
  EEPROM_1bit inst1438 (.CS(undriven_40), .IN(1'b0), .CS_O(inst1438_cs_o), .OUT(inst1_out));
  EEPROM_1bit inst1473 (.CS(undriven_41), .IN(1'b0), .CS_O(inst1473_cs_o), .OUT(inst1_out));
  EEPROM_1bit inst1507 (.CS(undriven_42), .IN(1'b0), .CS_O(inst1507_cs_o), .OUT(inst1_out));
  EEPROM_1bit inst1543 (.CS(undriven_43), .IN(1'b0), .CS_O(inst1543_cs_o), .OUT(inst1_out));
  EEPROM_1bit inst1579 (.CS(undriven_44), .IN(1'b0), .CS_O(inst1579_cs_o), .OUT(inst1_out));
  EEPROM_1bit inst1615 (.CS(undriven_45), .IN(1'b0), .CS_O(inst1615_cs_o), .OUT(inst1_out));
  EEPROM_1bit inst1651 (.CS(undriven_46), .IN(1'b0), .CS_O(inst1651_cs_o), .OUT(inst1_out));
  EEPROM_1bit inst1687 (.CS(undriven_47), .IN(1'b1), .CS_O(inst1687_cs_o), .OUT(inst1_out));
  EEPROM_1bit inst1722 (.CS(undriven_48), .IN(1'b0), .CS_O(inst1722_cs_o), .OUT(inst1_out));
  EEPROM_1bit inst1757 (.CS(undriven_49), .IN(1'b0), .CS_O(inst1757_cs_o), .OUT(inst1_out));
  EEPROM_1bit inst1791 (.CS(undriven_50), .IN(1'b0), .CS_O(inst1791_cs_o), .OUT(inst1_out));
  EEPROM_1bit inst1827 (.CS(undriven_51), .IN(1'b0), .CS_O(inst1827_cs_o), .OUT(inst1_out));
  EEPROM_1bit inst1863 (.CS(undriven_52), .IN(1'b0), .CS_O(inst1863_cs_o), .OUT(inst1_out));
  EEPROM_1bit inst2 (.CS(inst1_cs_o), .IN(1'b0), .CS_O(inst2_cs_o), .OUT(inst2_out));
  EEPROM_1bit inst20 (.CS(inst19_cs_o), .IN(1'b1), .CS_O(inst20_cs_o), .OUT(inst2_out));
  EEPROM_1bit inst58 (.CS(inst57_cs_o), .IN(1'b0), .CS_O(inst58_cs_o), .OUT(inst2_out));
  EEPROM_1bit inst124 (.CS(inst123_cs_o), .IN(1'b0), .CS_O(inst124_cs_o), .OUT(inst2_out));
  EEPROM_1bit inst160 (.CS(inst159_cs_o), .IN(1'b0), .CS_O(inst160_cs_o), .OUT(inst2_out));
  EEPROM_1bit inst196 (.CS(inst195_cs_o), .IN(1'b0), .CS_O(inst196_cs_o), .OUT(inst2_out));
  EEPROM_1bit inst232 (.CS(inst231_cs_o), .IN(1'b0), .CS_O(inst232_cs_o), .OUT(inst2_out));
  EEPROM_1bit inst268 (.CS(inst267_cs_o), .IN(1'b0), .CS_O(inst268_cs_o), .OUT(inst2_out));
  EEPROM_1bit inst303 (.CS(inst302_cs_o), .IN(1'b0), .CS_O(inst303_cs_o), .OUT(inst2_out));
  EEPROM_1bit inst338 (.CS(inst337_cs_o), .IN(1'b0), .CS_O(inst338_cs_o), .OUT(inst2_out));
  EEPROM_1bit inst372 (.CS(inst371_cs_o), .IN(1'b0), .CS_O(inst372_cs_o), .OUT(inst2_out));
  EEPROM_1bit inst408 (.CS(inst407_cs_o), .IN(1'b0), .CS_O(inst408_cs_o), .OUT(inst2_out));
  EEPROM_1bit inst444 (.CS(inst443_cs_o), .IN(1'b0), .CS_O(inst444_cs_o), .OUT(inst2_out));
  EEPROM_1bit inst480 (.CS(inst479_cs_o), .IN(1'b0), .CS_O(inst480_cs_o), .OUT(inst2_out));
  EEPROM_1bit inst516 (.CS(inst515_cs_o), .IN(1'b0), .CS_O(inst516_cs_o), .OUT(inst2_out));
  EEPROM_1bit inst552 (.CS(inst551_cs_o), .IN(1'b0), .CS_O(inst552_cs_o), .OUT(inst2_out));
  EEPROM_1bit inst587 (.CS(inst586_cs_o), .IN(1'b0), .CS_O(inst587_cs_o), .OUT(inst2_out));
  EEPROM_1bit inst622 (.CS(inst621_cs_o), .IN(1'b0), .CS_O(inst622_cs_o), .OUT(inst2_out));
  EEPROM_1bit inst656 (.CS(inst655_cs_o), .IN(1'b0), .CS_O(inst656_cs_o), .OUT(inst2_out));
  EEPROM_1bit inst692 (.CS(inst691_cs_o), .IN(1'b0), .CS_O(inst692_cs_o), .OUT(inst2_out));
  EEPROM_1bit inst728 (.CS(inst727_cs_o), .IN(1'b0), .CS_O(inst728_cs_o), .OUT(inst2_out));
  EEPROM_1bit inst764 (.CS(inst763_cs_o), .IN(1'b0), .CS_O(inst764_cs_o), .OUT(inst2_out));
  EEPROM_1bit inst800 (.CS(inst799_cs_o), .IN(1'b0), .CS_O(inst800_cs_o), .OUT(inst2_out));
  EEPROM_1bit inst836 (.CS(inst835_cs_o), .IN(1'b0), .CS_O(inst836_cs_o), .OUT(inst2_out));
  EEPROM_1bit inst871 (.CS(inst870_cs_o), .IN(1'b0), .CS_O(inst871_cs_o), .OUT(inst2_out));
  EEPROM_1bit inst906 (.CS(inst905_cs_o), .IN(1'b0), .CS_O(inst906_cs_o), .OUT(inst2_out));
  EEPROM_1bit inst940 (.CS(inst939_cs_o), .IN(1'b0), .CS_O(inst940_cs_o), .OUT(inst2_out));
  EEPROM_1bit inst976 (.CS(inst975_cs_o), .IN(1'b0), .CS_O(inst976_cs_o), .OUT(inst2_out));
  EEPROM_1bit inst1012 (.CS(inst1011_cs_o), .IN(1'b0), .CS_O(inst1012_cs_o), .OUT(inst2_out));
  EEPROM_1bit inst1048 (.CS(inst1047_cs_o), .IN(1'b0), .CS_O(inst1048_cs_o), .OUT(inst2_out));
  EEPROM_1bit inst1084 (.CS(inst1083_cs_o), .IN(1'b0), .CS_O(inst1084_cs_o), .OUT(inst2_out));
  EEPROM_1bit inst1120 (.CS(inst1119_cs_o), .IN(1'b0), .CS_O(inst1120_cs_o), .OUT(inst2_out));
  EEPROM_1bit inst1155 (.CS(inst1154_cs_o), .IN(1'b0), .CS_O(inst1155_cs_o), .OUT(inst2_out));
  EEPROM_1bit inst1190 (.CS(inst1189_cs_o), .IN(1'b0), .CS_O(inst1190_cs_o), .OUT(inst2_out));
  EEPROM_1bit inst1224 (.CS(inst1223_cs_o), .IN(1'b0), .CS_O(inst1224_cs_o), .OUT(inst2_out));
  EEPROM_1bit inst1260 (.CS(inst1259_cs_o), .IN(1'b0), .CS_O(inst1260_cs_o), .OUT(inst2_out));
  EEPROM_1bit inst1296 (.CS(inst1295_cs_o), .IN(1'b0), .CS_O(inst1296_cs_o), .OUT(inst2_out));
  EEPROM_1bit inst1332 (.CS(inst1331_cs_o), .IN(1'b0), .CS_O(inst1332_cs_o), .OUT(inst2_out));
  EEPROM_1bit inst1368 (.CS(inst1367_cs_o), .IN(1'b0), .CS_O(inst1368_cs_o), .OUT(inst2_out));
  EEPROM_1bit inst1404 (.CS(inst1403_cs_o), .IN(1'b0), .CS_O(inst1404_cs_o), .OUT(inst2_out));
  EEPROM_1bit inst1439 (.CS(inst1438_cs_o), .IN(1'b0), .CS_O(inst1439_cs_o), .OUT(inst2_out));
  EEPROM_1bit inst1474 (.CS(inst1473_cs_o), .IN(1'b0), .CS_O(inst1474_cs_o), .OUT(inst2_out));
  EEPROM_1bit inst1508 (.CS(inst1507_cs_o), .IN(1'b0), .CS_O(inst1508_cs_o), .OUT(inst2_out));
  EEPROM_1bit inst1544 (.CS(inst1543_cs_o), .IN(1'b0), .CS_O(inst1544_cs_o), .OUT(inst2_out));
  EEPROM_1bit inst1580 (.CS(inst1579_cs_o), .IN(1'b0), .CS_O(inst1580_cs_o), .OUT(inst2_out));
  EEPROM_1bit inst1616 (.CS(inst1615_cs_o), .IN(1'b0), .CS_O(inst1616_cs_o), .OUT(inst2_out));
  EEPROM_1bit inst1652 (.CS(inst1651_cs_o), .IN(1'b0), .CS_O(inst1652_cs_o), .OUT(inst2_out));
  EEPROM_1bit inst1688 (.CS(inst1687_cs_o), .IN(1'b0), .CS_O(inst1688_cs_o), .OUT(inst2_out));
  EEPROM_1bit inst1723 (.CS(inst1722_cs_o), .IN(1'b0), .CS_O(inst1723_cs_o), .OUT(inst2_out));
  EEPROM_1bit inst1758 (.CS(inst1757_cs_o), .IN(1'b0), .CS_O(inst1758_cs_o), .OUT(inst2_out));
  EEPROM_1bit inst1792 (.CS(inst1791_cs_o), .IN(1'b0), .CS_O(inst1792_cs_o), .OUT(inst2_out));
  EEPROM_1bit inst1828 (.CS(inst1827_cs_o), .IN(1'b0), .CS_O(inst1828_cs_o), .OUT(inst2_out));
  EEPROM_1bit inst1864 (.CS(inst1863_cs_o), .IN(1'b0), .CS_O(inst1864_cs_o), .OUT(inst2_out));
  EEPROM_1bit inst3 (.CS(inst2_cs_o), .IN(1'b0), .CS_O(inst3_cs_o), .OUT(inst3_out));
  EEPROM_1bit inst21 (.CS(inst20_cs_o), .IN(1'b0), .CS_O(inst21_cs_o), .OUT(inst3_out));
  EEPROM_1bit inst59 (.CS(inst58_cs_o), .IN(1'b0), .CS_O(inst59_cs_o), .OUT(inst3_out));
  EEPROM_1bit inst125 (.CS(inst124_cs_o), .IN(1'b0), .CS_O(inst125_cs_o), .OUT(inst3_out));
  EEPROM_1bit inst161 (.CS(inst160_cs_o), .IN(1'b0), .CS_O(inst161_cs_o), .OUT(inst3_out));
  EEPROM_1bit inst197 (.CS(inst196_cs_o), .IN(1'b0), .CS_O(inst197_cs_o), .OUT(inst3_out));
  EEPROM_1bit inst233 (.CS(inst232_cs_o), .IN(1'b0), .CS_O(inst233_cs_o), .OUT(inst3_out));
  EEPROM_1bit inst269 (.CS(inst268_cs_o), .IN(1'b0), .CS_O(inst269_cs_o), .OUT(inst3_out));
  EEPROM_1bit inst304 (.CS(inst303_cs_o), .IN(1'b0), .CS_O(inst304_cs_o), .OUT(inst3_out));
  EEPROM_1bit inst339 (.CS(inst338_cs_o), .IN(1'b0), .CS_O(inst339_cs_o), .OUT(inst3_out));
  EEPROM_1bit inst373 (.CS(inst372_cs_o), .IN(1'b0), .CS_O(inst373_cs_o), .OUT(inst3_out));
  EEPROM_1bit inst409 (.CS(inst408_cs_o), .IN(1'b0), .CS_O(inst409_cs_o), .OUT(inst3_out));
  EEPROM_1bit inst445 (.CS(inst444_cs_o), .IN(1'b0), .CS_O(inst445_cs_o), .OUT(inst3_out));
  EEPROM_1bit inst481 (.CS(inst480_cs_o), .IN(1'b0), .CS_O(inst481_cs_o), .OUT(inst3_out));
  EEPROM_1bit inst517 (.CS(inst516_cs_o), .IN(1'b0), .CS_O(inst517_cs_o), .OUT(inst3_out));
  EEPROM_1bit inst553 (.CS(inst552_cs_o), .IN(1'b0), .CS_O(inst553_cs_o), .OUT(inst3_out));
  EEPROM_1bit inst588 (.CS(inst587_cs_o), .IN(1'b0), .CS_O(inst588_cs_o), .OUT(inst3_out));
  EEPROM_1bit inst623 (.CS(inst622_cs_o), .IN(1'b0), .CS_O(inst623_cs_o), .OUT(inst3_out));
  EEPROM_1bit inst657 (.CS(inst656_cs_o), .IN(1'b0), .CS_O(inst657_cs_o), .OUT(inst3_out));
  EEPROM_1bit inst693 (.CS(inst692_cs_o), .IN(1'b0), .CS_O(inst693_cs_o), .OUT(inst3_out));
  EEPROM_1bit inst729 (.CS(inst728_cs_o), .IN(1'b0), .CS_O(inst729_cs_o), .OUT(inst3_out));
  EEPROM_1bit inst765 (.CS(inst764_cs_o), .IN(1'b0), .CS_O(inst765_cs_o), .OUT(inst3_out));
  EEPROM_1bit inst801 (.CS(inst800_cs_o), .IN(1'b0), .CS_O(inst801_cs_o), .OUT(inst3_out));
  EEPROM_1bit inst837 (.CS(inst836_cs_o), .IN(1'b0), .CS_O(inst837_cs_o), .OUT(inst3_out));
  EEPROM_1bit inst872 (.CS(inst871_cs_o), .IN(1'b0), .CS_O(inst872_cs_o), .OUT(inst3_out));
  EEPROM_1bit inst907 (.CS(inst906_cs_o), .IN(1'b0), .CS_O(inst907_cs_o), .OUT(inst3_out));
  EEPROM_1bit inst941 (.CS(inst940_cs_o), .IN(1'b0), .CS_O(inst941_cs_o), .OUT(inst3_out));
  EEPROM_1bit inst977 (.CS(inst976_cs_o), .IN(1'b0), .CS_O(inst977_cs_o), .OUT(inst3_out));
  EEPROM_1bit inst1013 (.CS(inst1012_cs_o), .IN(1'b0), .CS_O(inst1013_cs_o), .OUT(inst3_out));
  EEPROM_1bit inst1049 (.CS(inst1048_cs_o), .IN(1'b0), .CS_O(inst1049_cs_o), .OUT(inst3_out));
  EEPROM_1bit inst1085 (.CS(inst1084_cs_o), .IN(1'b0), .CS_O(inst1085_cs_o), .OUT(inst3_out));
  EEPROM_1bit inst1121 (.CS(inst1120_cs_o), .IN(1'b0), .CS_O(inst1121_cs_o), .OUT(inst3_out));
  EEPROM_1bit inst1156 (.CS(inst1155_cs_o), .IN(1'b1), .CS_O(inst1156_cs_o), .OUT(inst3_out));
  EEPROM_1bit inst1191 (.CS(inst1190_cs_o), .IN(1'b0), .CS_O(inst1191_cs_o), .OUT(inst3_out));
  EEPROM_1bit inst1225 (.CS(inst1224_cs_o), .IN(1'b0), .CS_O(inst1225_cs_o), .OUT(inst3_out));
  EEPROM_1bit inst1261 (.CS(inst1260_cs_o), .IN(1'b0), .CS_O(inst1261_cs_o), .OUT(inst3_out));
  EEPROM_1bit inst1297 (.CS(inst1296_cs_o), .IN(1'b0), .CS_O(inst1297_cs_o), .OUT(inst3_out));
  EEPROM_1bit inst1333 (.CS(inst1332_cs_o), .IN(1'b0), .CS_O(inst1333_cs_o), .OUT(inst3_out));
  EEPROM_1bit inst1369 (.CS(inst1368_cs_o), .IN(1'b0), .CS_O(inst1369_cs_o), .OUT(inst3_out));
  EEPROM_1bit inst1405 (.CS(inst1404_cs_o), .IN(1'b0), .CS_O(inst1405_cs_o), .OUT(inst3_out));
  EEPROM_1bit inst1440 (.CS(inst1439_cs_o), .IN(1'b0), .CS_O(inst1440_cs_o), .OUT(inst3_out));
  EEPROM_1bit inst1475 (.CS(inst1474_cs_o), .IN(1'b0), .CS_O(inst1475_cs_o), .OUT(inst3_out));
  EEPROM_1bit inst1509 (.CS(inst1508_cs_o), .IN(1'b0), .CS_O(inst1509_cs_o), .OUT(inst3_out));
  EEPROM_1bit inst1545 (.CS(inst1544_cs_o), .IN(1'b0), .CS_O(inst1545_cs_o), .OUT(inst3_out));
  EEPROM_1bit inst1581 (.CS(inst1580_cs_o), .IN(1'b0), .CS_O(inst1581_cs_o), .OUT(inst3_out));
  EEPROM_1bit inst1617 (.CS(inst1616_cs_o), .IN(1'b0), .CS_O(inst1617_cs_o), .OUT(inst3_out));
  EEPROM_1bit inst1653 (.CS(inst1652_cs_o), .IN(1'b0), .CS_O(inst1653_cs_o), .OUT(inst3_out));
  EEPROM_1bit inst1689 (.CS(inst1688_cs_o), .IN(1'b0), .CS_O(inst1689_cs_o), .OUT(inst3_out));
  EEPROM_1bit inst1724 (.CS(inst1723_cs_o), .IN(1'b0), .CS_O(inst1724_cs_o), .OUT(inst3_out));
  EEPROM_1bit inst1759 (.CS(inst1758_cs_o), .IN(1'b0), .CS_O(inst1759_cs_o), .OUT(inst3_out));
  EEPROM_1bit inst1793 (.CS(inst1792_cs_o), .IN(1'b0), .CS_O(inst1793_cs_o), .OUT(inst3_out));
  EEPROM_1bit inst1829 (.CS(inst1828_cs_o), .IN(1'b0), .CS_O(inst1829_cs_o), .OUT(inst3_out));
  EEPROM_1bit inst1865 (.CS(inst1864_cs_o), .IN(1'b0), .CS_O(inst1865_cs_o), .OUT(inst3_out));
  EEPROM_1bit inst4 (.CS(inst3_cs_o), .IN(1'b1), .CS_O(inst4_cs_o), .OUT(inst4_out));
  EEPROM_1bit inst22 (.CS(inst21_cs_o), .IN(1'b0), .CS_O(inst22_cs_o), .OUT(inst4_out));
  EEPROM_1bit inst60 (.CS(inst59_cs_o), .IN(1'b0), .CS_O(inst60_cs_o), .OUT(inst4_out));
  EEPROM_1bit inst126 (.CS(inst125_cs_o), .IN(1'b0), .CS_O(inst126_cs_o), .OUT(inst4_out));
  EEPROM_1bit inst162 (.CS(inst161_cs_o), .IN(1'b0), .CS_O(inst162_cs_o), .OUT(inst4_out));
  EEPROM_1bit inst198 (.CS(inst197_cs_o), .IN(1'b0), .CS_O(inst198_cs_o), .OUT(inst4_out));
  EEPROM_1bit inst234 (.CS(inst233_cs_o), .IN(1'b0), .CS_O(inst234_cs_o), .OUT(inst4_out));
  EEPROM_1bit inst270 (.CS(inst269_cs_o), .IN(1'b0), .CS_O(inst270_cs_o), .OUT(inst4_out));
  EEPROM_1bit inst305 (.CS(inst304_cs_o), .IN(1'b0), .CS_O(inst305_cs_o), .OUT(inst4_out));
  EEPROM_1bit inst340 (.CS(inst339_cs_o), .IN(1'b0), .CS_O(inst340_cs_o), .OUT(inst4_out));
  EEPROM_1bit inst374 (.CS(inst373_cs_o), .IN(1'b0), .CS_O(inst374_cs_o), .OUT(inst4_out));
  EEPROM_1bit inst410 (.CS(inst409_cs_o), .IN(1'b0), .CS_O(inst410_cs_o), .OUT(inst4_out));
  EEPROM_1bit inst446 (.CS(inst445_cs_o), .IN(1'b0), .CS_O(inst446_cs_o), .OUT(inst4_out));
  EEPROM_1bit inst482 (.CS(inst481_cs_o), .IN(1'b0), .CS_O(inst482_cs_o), .OUT(inst4_out));
  EEPROM_1bit inst518 (.CS(inst517_cs_o), .IN(1'b0), .CS_O(inst518_cs_o), .OUT(inst4_out));
  EEPROM_1bit inst554 (.CS(inst553_cs_o), .IN(1'b0), .CS_O(inst554_cs_o), .OUT(inst4_out));
  EEPROM_1bit inst589 (.CS(inst588_cs_o), .IN(1'b0), .CS_O(inst589_cs_o), .OUT(inst4_out));
  EEPROM_1bit inst624 (.CS(inst623_cs_o), .IN(1'b0), .CS_O(inst624_cs_o), .OUT(inst4_out));
  EEPROM_1bit inst658 (.CS(inst657_cs_o), .IN(1'b0), .CS_O(inst658_cs_o), .OUT(inst4_out));
  EEPROM_1bit inst694 (.CS(inst693_cs_o), .IN(1'b0), .CS_O(inst694_cs_o), .OUT(inst4_out));
  EEPROM_1bit inst730 (.CS(inst729_cs_o), .IN(1'b0), .CS_O(inst730_cs_o), .OUT(inst4_out));
  EEPROM_1bit inst766 (.CS(inst765_cs_o), .IN(1'b0), .CS_O(inst766_cs_o), .OUT(inst4_out));
  EEPROM_1bit inst802 (.CS(inst801_cs_o), .IN(1'b0), .CS_O(inst802_cs_o), .OUT(inst4_out));
  EEPROM_1bit inst838 (.CS(inst837_cs_o), .IN(1'b0), .CS_O(inst838_cs_o), .OUT(inst4_out));
  EEPROM_1bit inst873 (.CS(inst872_cs_o), .IN(1'b0), .CS_O(inst873_cs_o), .OUT(inst4_out));
  EEPROM_1bit inst908 (.CS(inst907_cs_o), .IN(1'b0), .CS_O(inst908_cs_o), .OUT(inst4_out));
  EEPROM_1bit inst942 (.CS(inst941_cs_o), .IN(1'b0), .CS_O(inst942_cs_o), .OUT(inst4_out));
  EEPROM_1bit inst978 (.CS(inst977_cs_o), .IN(1'b0), .CS_O(inst978_cs_o), .OUT(inst4_out));
  EEPROM_1bit inst1014 (.CS(inst1013_cs_o), .IN(1'b0), .CS_O(inst1014_cs_o), .OUT(inst4_out));
  EEPROM_1bit inst1050 (.CS(inst1049_cs_o), .IN(1'b0), .CS_O(inst1050_cs_o), .OUT(inst4_out));
  EEPROM_1bit inst1086 (.CS(inst1085_cs_o), .IN(1'b0), .CS_O(inst1086_cs_o), .OUT(inst4_out));
  EEPROM_1bit inst1122 (.CS(inst1121_cs_o), .IN(1'b0), .CS_O(inst1122_cs_o), .OUT(inst4_out));
  EEPROM_1bit inst1157 (.CS(inst1156_cs_o), .IN(1'b0), .CS_O(inst1157_cs_o), .OUT(inst4_out));
  EEPROM_1bit inst1192 (.CS(inst1191_cs_o), .IN(1'b0), .CS_O(inst1192_cs_o), .OUT(inst4_out));
  EEPROM_1bit inst1226 (.CS(inst1225_cs_o), .IN(1'b0), .CS_O(inst1226_cs_o), .OUT(inst4_out));
  EEPROM_1bit inst1262 (.CS(inst1261_cs_o), .IN(1'b0), .CS_O(inst1262_cs_o), .OUT(inst4_out));
  EEPROM_1bit inst1298 (.CS(inst1297_cs_o), .IN(1'b0), .CS_O(inst1298_cs_o), .OUT(inst4_out));
  EEPROM_1bit inst1334 (.CS(inst1333_cs_o), .IN(1'b0), .CS_O(inst1334_cs_o), .OUT(inst4_out));
  EEPROM_1bit inst1370 (.CS(inst1369_cs_o), .IN(1'b0), .CS_O(inst1370_cs_o), .OUT(inst4_out));
  EEPROM_1bit inst1406 (.CS(inst1405_cs_o), .IN(1'b0), .CS_O(inst1406_cs_o), .OUT(inst4_out));
  EEPROM_1bit inst1441 (.CS(inst1440_cs_o), .IN(1'b0), .CS_O(inst1441_cs_o), .OUT(inst4_out));
  EEPROM_1bit inst1476 (.CS(inst1475_cs_o), .IN(1'b0), .CS_O(inst1476_cs_o), .OUT(inst4_out));
  EEPROM_1bit inst1510 (.CS(inst1509_cs_o), .IN(1'b0), .CS_O(inst1510_cs_o), .OUT(inst4_out));
  EEPROM_1bit inst1546 (.CS(inst1545_cs_o), .IN(1'b0), .CS_O(inst1546_cs_o), .OUT(inst4_out));
  EEPROM_1bit inst1582 (.CS(inst1581_cs_o), .IN(1'b0), .CS_O(inst1582_cs_o), .OUT(inst4_out));
  EEPROM_1bit inst1618 (.CS(inst1617_cs_o), .IN(1'b0), .CS_O(inst1618_cs_o), .OUT(inst4_out));
  EEPROM_1bit inst1654 (.CS(inst1653_cs_o), .IN(1'b0), .CS_O(inst1654_cs_o), .OUT(inst4_out));
  EEPROM_1bit inst1690 (.CS(inst1689_cs_o), .IN(1'b0), .CS_O(inst1690_cs_o), .OUT(inst4_out));
  EEPROM_1bit inst1725 (.CS(inst1724_cs_o), .IN(1'b0), .CS_O(inst1725_cs_o), .OUT(inst4_out));
  EEPROM_1bit inst1760 (.CS(inst1759_cs_o), .IN(1'b0), .CS_O(inst1760_cs_o), .OUT(inst4_out));
  EEPROM_1bit inst1794 (.CS(inst1793_cs_o), .IN(1'b0), .CS_O(inst1794_cs_o), .OUT(inst4_out));
  EEPROM_1bit inst1830 (.CS(inst1829_cs_o), .IN(1'b0), .CS_O(inst1830_cs_o), .OUT(inst4_out));
  EEPROM_1bit inst1866 (.CS(inst1865_cs_o), .IN(1'b0), .CS_O(inst1866_cs_o), .OUT(inst4_out));
  EEPROM_1bit inst5 (.CS(inst4_cs_o), .IN(1'b1), .CS_O(inst5_cs_o), .OUT(inst5_out));
  EEPROM_1bit inst23 (.CS(inst22_cs_o), .IN(1'b0), .CS_O(inst23_cs_o), .OUT(inst5_out));
  EEPROM_1bit inst61 (.CS(inst60_cs_o), .IN(1'b0), .CS_O(inst61_cs_o), .OUT(inst5_out));
  EEPROM_1bit inst127 (.CS(inst126_cs_o), .IN(1'b0), .CS_O(inst127_cs_o), .OUT(inst5_out));
  EEPROM_1bit inst163 (.CS(inst162_cs_o), .IN(1'b0), .CS_O(inst163_cs_o), .OUT(inst5_out));
  EEPROM_1bit inst199 (.CS(inst198_cs_o), .IN(1'b1), .CS_O(inst199_cs_o), .OUT(inst5_out));
  EEPROM_1bit inst235 (.CS(inst234_cs_o), .IN(1'b0), .CS_O(inst235_cs_o), .OUT(inst5_out));
  EEPROM_1bit inst271 (.CS(inst270_cs_o), .IN(1'b0), .CS_O(inst271_cs_o), .OUT(inst5_out));
  EEPROM_1bit inst306 (.CS(inst305_cs_o), .IN(1'b0), .CS_O(inst306_cs_o), .OUT(inst5_out));
  EEPROM_1bit inst341 (.CS(inst340_cs_o), .IN(1'b0), .CS_O(inst341_cs_o), .OUT(inst5_out));
  EEPROM_1bit inst375 (.CS(inst374_cs_o), .IN(1'b0), .CS_O(inst375_cs_o), .OUT(inst5_out));
  EEPROM_1bit inst411 (.CS(inst410_cs_o), .IN(1'b1), .CS_O(inst411_cs_o), .OUT(inst5_out));
  EEPROM_1bit inst447 (.CS(inst446_cs_o), .IN(1'b0), .CS_O(inst447_cs_o), .OUT(inst5_out));
  EEPROM_1bit inst483 (.CS(inst482_cs_o), .IN(1'b0), .CS_O(inst483_cs_o), .OUT(inst5_out));
  EEPROM_1bit inst519 (.CS(inst518_cs_o), .IN(1'b1), .CS_O(inst519_cs_o), .OUT(inst5_out));
  EEPROM_1bit inst555 (.CS(inst554_cs_o), .IN(1'b0), .CS_O(inst555_cs_o), .OUT(inst5_out));
  EEPROM_1bit inst590 (.CS(inst589_cs_o), .IN(1'b0), .CS_O(inst590_cs_o), .OUT(inst5_out));
  EEPROM_1bit inst625 (.CS(inst624_cs_o), .IN(1'b1), .CS_O(inst625_cs_o), .OUT(inst5_out));
  EEPROM_1bit inst659 (.CS(inst658_cs_o), .IN(1'b0), .CS_O(inst659_cs_o), .OUT(inst5_out));
  EEPROM_1bit inst695 (.CS(inst694_cs_o), .IN(1'b0), .CS_O(inst695_cs_o), .OUT(inst5_out));
  EEPROM_1bit inst731 (.CS(inst730_cs_o), .IN(1'b1), .CS_O(inst731_cs_o), .OUT(inst5_out));
  EEPROM_1bit inst767 (.CS(inst766_cs_o), .IN(1'b0), .CS_O(inst767_cs_o), .OUT(inst5_out));
  EEPROM_1bit inst803 (.CS(inst802_cs_o), .IN(1'b0), .CS_O(inst803_cs_o), .OUT(inst5_out));
  EEPROM_1bit inst839 (.CS(inst838_cs_o), .IN(1'b1), .CS_O(inst839_cs_o), .OUT(inst5_out));
  EEPROM_1bit inst874 (.CS(inst873_cs_o), .IN(1'b0), .CS_O(inst874_cs_o), .OUT(inst5_out));
  EEPROM_1bit inst909 (.CS(inst908_cs_o), .IN(1'b0), .CS_O(inst909_cs_o), .OUT(inst5_out));
  EEPROM_1bit inst943 (.CS(inst942_cs_o), .IN(1'b1), .CS_O(inst943_cs_o), .OUT(inst5_out));
  EEPROM_1bit inst979 (.CS(inst978_cs_o), .IN(1'b0), .CS_O(inst979_cs_o), .OUT(inst5_out));
  EEPROM_1bit inst1015 (.CS(inst1014_cs_o), .IN(1'b0), .CS_O(inst1015_cs_o), .OUT(inst5_out));
  EEPROM_1bit inst1051 (.CS(inst1050_cs_o), .IN(1'b0), .CS_O(inst1051_cs_o), .OUT(inst5_out));
  EEPROM_1bit inst1087 (.CS(inst1086_cs_o), .IN(1'b0), .CS_O(inst1087_cs_o), .OUT(inst5_out));
  EEPROM_1bit inst1123 (.CS(inst1122_cs_o), .IN(1'b0), .CS_O(inst1123_cs_o), .OUT(inst5_out));
  EEPROM_1bit inst1158 (.CS(inst1157_cs_o), .IN(1'b0), .CS_O(inst1158_cs_o), .OUT(inst5_out));
  EEPROM_1bit inst1193 (.CS(inst1192_cs_o), .IN(1'b0), .CS_O(inst1193_cs_o), .OUT(inst5_out));
  EEPROM_1bit inst1227 (.CS(inst1226_cs_o), .IN(1'b0), .CS_O(inst1227_cs_o), .OUT(inst5_out));
  EEPROM_1bit inst1263 (.CS(inst1262_cs_o), .IN(1'b0), .CS_O(inst1263_cs_o), .OUT(inst5_out));
  EEPROM_1bit inst1299 (.CS(inst1298_cs_o), .IN(1'b0), .CS_O(inst1299_cs_o), .OUT(inst5_out));
  EEPROM_1bit inst1335 (.CS(inst1334_cs_o), .IN(1'b0), .CS_O(inst1335_cs_o), .OUT(inst5_out));
  EEPROM_1bit inst1371 (.CS(inst1370_cs_o), .IN(1'b0), .CS_O(inst1371_cs_o), .OUT(inst5_out));
  EEPROM_1bit inst1407 (.CS(inst1406_cs_o), .IN(1'b0), .CS_O(inst1407_cs_o), .OUT(inst5_out));
  EEPROM_1bit inst1442 (.CS(inst1441_cs_o), .IN(1'b0), .CS_O(inst1442_cs_o), .OUT(inst5_out));
  EEPROM_1bit inst1477 (.CS(inst1476_cs_o), .IN(1'b0), .CS_O(inst1477_cs_o), .OUT(inst5_out));
  EEPROM_1bit inst1511 (.CS(inst1510_cs_o), .IN(1'b0), .CS_O(inst1511_cs_o), .OUT(inst5_out));
  EEPROM_1bit inst1547 (.CS(inst1546_cs_o), .IN(1'b0), .CS_O(inst1547_cs_o), .OUT(inst5_out));
  EEPROM_1bit inst1583 (.CS(inst1582_cs_o), .IN(1'b0), .CS_O(inst1583_cs_o), .OUT(inst5_out));
  EEPROM_1bit inst1619 (.CS(inst1618_cs_o), .IN(1'b0), .CS_O(inst1619_cs_o), .OUT(inst5_out));
  EEPROM_1bit inst1655 (.CS(inst1654_cs_o), .IN(1'b0), .CS_O(inst1655_cs_o), .OUT(inst5_out));
  EEPROM_1bit inst1691 (.CS(inst1690_cs_o), .IN(1'b0), .CS_O(inst1691_cs_o), .OUT(inst5_out));
  EEPROM_1bit inst1726 (.CS(inst1725_cs_o), .IN(1'b0), .CS_O(inst1726_cs_o), .OUT(inst5_out));
  EEPROM_1bit inst1761 (.CS(inst1760_cs_o), .IN(1'b0), .CS_O(inst1761_cs_o), .OUT(inst5_out));
  EEPROM_1bit inst1795 (.CS(inst1794_cs_o), .IN(1'b0), .CS_O(inst1795_cs_o), .OUT(inst5_out));
  EEPROM_1bit inst1831 (.CS(inst1830_cs_o), .IN(1'b0), .CS_O(inst1831_cs_o), .OUT(inst5_out));
  EEPROM_1bit inst1867 (.CS(inst1866_cs_o), .IN(1'b0), .CS_O(inst1867_cs_o), .OUT(inst5_out));
  EEPROM_1bit inst6 (.CS(inst5_cs_o), .IN(1'b0), .CS_O(inst6_cs_o), .OUT(inst6_out));
  EEPROM_1bit inst24 (.CS(inst23_cs_o), .IN(1'b0), .CS_O(inst24_cs_o), .OUT(inst6_out));
  EEPROM_1bit inst62 (.CS(inst61_cs_o), .IN(1'b0), .CS_O(inst62_cs_o), .OUT(inst6_out));
  EEPROM_1bit inst128 (.CS(inst127_cs_o), .IN(1'b0), .CS_O(inst128_cs_o), .OUT(inst6_out));
  EEPROM_1bit inst164 (.CS(inst163_cs_o), .IN(1'b0), .CS_O(inst164_cs_o), .OUT(inst6_out));
  EEPROM_1bit inst200 (.CS(inst199_cs_o), .IN(1'b0), .CS_O(inst200_cs_o), .OUT(inst6_out));
  EEPROM_1bit inst236 (.CS(inst235_cs_o), .IN(1'b0), .CS_O(inst236_cs_o), .OUT(inst6_out));
  EEPROM_1bit inst272 (.CS(inst271_cs_o), .IN(1'b0), .CS_O(inst272_cs_o), .OUT(inst6_out));
  EEPROM_1bit inst307 (.CS(inst306_cs_o), .IN(1'b0), .CS_O(inst307_cs_o), .OUT(inst6_out));
  EEPROM_1bit inst342 (.CS(inst341_cs_o), .IN(1'b0), .CS_O(inst342_cs_o), .OUT(inst6_out));
  EEPROM_1bit inst376 (.CS(inst375_cs_o), .IN(1'b0), .CS_O(inst376_cs_o), .OUT(inst6_out));
  EEPROM_1bit inst412 (.CS(inst411_cs_o), .IN(1'b0), .CS_O(inst412_cs_o), .OUT(inst6_out));
  EEPROM_1bit inst448 (.CS(inst447_cs_o), .IN(1'b1), .CS_O(inst448_cs_o), .OUT(inst6_out));
  EEPROM_1bit inst484 (.CS(inst483_cs_o), .IN(1'b0), .CS_O(inst484_cs_o), .OUT(inst6_out));
  EEPROM_1bit inst520 (.CS(inst519_cs_o), .IN(1'b0), .CS_O(inst520_cs_o), .OUT(inst6_out));
  EEPROM_1bit inst556 (.CS(inst555_cs_o), .IN(1'b0), .CS_O(inst556_cs_o), .OUT(inst6_out));
  EEPROM_1bit inst591 (.CS(inst590_cs_o), .IN(1'b0), .CS_O(inst591_cs_o), .OUT(inst6_out));
  EEPROM_1bit inst626 (.CS(inst625_cs_o), .IN(1'b0), .CS_O(inst626_cs_o), .OUT(inst6_out));
  EEPROM_1bit inst660 (.CS(inst659_cs_o), .IN(1'b0), .CS_O(inst660_cs_o), .OUT(inst6_out));
  EEPROM_1bit inst696 (.CS(inst695_cs_o), .IN(1'b0), .CS_O(inst696_cs_o), .OUT(inst6_out));
  EEPROM_1bit inst732 (.CS(inst731_cs_o), .IN(1'b0), .CS_O(inst732_cs_o), .OUT(inst6_out));
  EEPROM_1bit inst768 (.CS(inst767_cs_o), .IN(1'b0), .CS_O(inst768_cs_o), .OUT(inst6_out));
  EEPROM_1bit inst804 (.CS(inst803_cs_o), .IN(1'b0), .CS_O(inst804_cs_o), .OUT(inst6_out));
  EEPROM_1bit inst840 (.CS(inst839_cs_o), .IN(1'b0), .CS_O(inst840_cs_o), .OUT(inst6_out));
  EEPROM_1bit inst875 (.CS(inst874_cs_o), .IN(1'b0), .CS_O(inst875_cs_o), .OUT(inst6_out));
  EEPROM_1bit inst910 (.CS(inst909_cs_o), .IN(1'b0), .CS_O(inst910_cs_o), .OUT(inst6_out));
  EEPROM_1bit inst944 (.CS(inst943_cs_o), .IN(1'b0), .CS_O(inst944_cs_o), .OUT(inst6_out));
  EEPROM_1bit inst980 (.CS(inst979_cs_o), .IN(1'b0), .CS_O(inst980_cs_o), .OUT(inst6_out));
  EEPROM_1bit inst1016 (.CS(inst1015_cs_o), .IN(1'b0), .CS_O(inst1016_cs_o), .OUT(inst6_out));
  EEPROM_1bit inst1052 (.CS(inst1051_cs_o), .IN(1'b0), .CS_O(inst1052_cs_o), .OUT(inst6_out));
  EEPROM_1bit inst1088 (.CS(inst1087_cs_o), .IN(1'b0), .CS_O(inst1088_cs_o), .OUT(inst6_out));
  EEPROM_1bit inst1124 (.CS(inst1123_cs_o), .IN(1'b0), .CS_O(inst1124_cs_o), .OUT(inst6_out));
  EEPROM_1bit inst1159 (.CS(inst1158_cs_o), .IN(1'b0), .CS_O(inst1159_cs_o), .OUT(inst6_out));
  EEPROM_1bit inst1194 (.CS(inst1193_cs_o), .IN(1'b0), .CS_O(inst1194_cs_o), .OUT(inst6_out));
  EEPROM_1bit inst1228 (.CS(inst1227_cs_o), .IN(1'b0), .CS_O(inst1228_cs_o), .OUT(inst6_out));
  EEPROM_1bit inst1264 (.CS(inst1263_cs_o), .IN(1'b0), .CS_O(inst1264_cs_o), .OUT(inst6_out));
  EEPROM_1bit inst1300 (.CS(inst1299_cs_o), .IN(1'b0), .CS_O(inst1300_cs_o), .OUT(inst6_out));
  EEPROM_1bit inst1336 (.CS(inst1335_cs_o), .IN(1'b0), .CS_O(inst1336_cs_o), .OUT(inst6_out));
  EEPROM_1bit inst1372 (.CS(inst1371_cs_o), .IN(1'b0), .CS_O(inst1372_cs_o), .OUT(inst6_out));
  EEPROM_1bit inst1408 (.CS(inst1407_cs_o), .IN(1'b0), .CS_O(inst1408_cs_o), .OUT(inst6_out));
  EEPROM_1bit inst1443 (.CS(inst1442_cs_o), .IN(1'b0), .CS_O(inst1443_cs_o), .OUT(inst6_out));
  EEPROM_1bit inst1478 (.CS(inst1477_cs_o), .IN(1'b0), .CS_O(inst1478_cs_o), .OUT(inst6_out));
  EEPROM_1bit inst1512 (.CS(inst1511_cs_o), .IN(1'b0), .CS_O(inst1512_cs_o), .OUT(inst6_out));
  EEPROM_1bit inst1548 (.CS(inst1547_cs_o), .IN(1'b0), .CS_O(inst1548_cs_o), .OUT(inst6_out));
  EEPROM_1bit inst1584 (.CS(inst1583_cs_o), .IN(1'b0), .CS_O(inst1584_cs_o), .OUT(inst6_out));
  EEPROM_1bit inst1620 (.CS(inst1619_cs_o), .IN(1'b0), .CS_O(inst1620_cs_o), .OUT(inst6_out));
  EEPROM_1bit inst1656 (.CS(inst1655_cs_o), .IN(1'b0), .CS_O(inst1656_cs_o), .OUT(inst6_out));
  EEPROM_1bit inst1692 (.CS(inst1691_cs_o), .IN(1'b0), .CS_O(inst1692_cs_o), .OUT(inst6_out));
  EEPROM_1bit inst1727 (.CS(inst1726_cs_o), .IN(1'b0), .CS_O(inst1727_cs_o), .OUT(inst6_out));
  EEPROM_1bit inst1762 (.CS(inst1761_cs_o), .IN(1'b0), .CS_O(inst1762_cs_o), .OUT(inst6_out));
  EEPROM_1bit inst1796 (.CS(inst1795_cs_o), .IN(1'b0), .CS_O(inst1796_cs_o), .OUT(inst6_out));
  EEPROM_1bit inst1832 (.CS(inst1831_cs_o), .IN(1'b0), .CS_O(inst1832_cs_o), .OUT(inst6_out));
  EEPROM_1bit inst1868 (.CS(inst1867_cs_o), .IN(1'b0), .CS_O(inst1868_cs_o), .OUT(inst6_out));
  EEPROM_1bit inst7 (.CS(inst6_cs_o), .IN(1'b0), .CS_O(inst7_cs_o), .OUT(inst7_out));
  EEPROM_1bit inst25 (.CS(inst24_cs_o), .IN(1'b1), .CS_O(inst25_cs_o), .OUT(inst7_out));
  EEPROM_1bit inst63 (.CS(inst62_cs_o), .IN(1'b0), .CS_O(inst63_cs_o), .OUT(inst7_out));
  EEPROM_1bit inst129 (.CS(inst128_cs_o), .IN(1'b0), .CS_O(inst129_cs_o), .OUT(inst7_out));
  EEPROM_1bit inst165 (.CS(inst164_cs_o), .IN(1'b0), .CS_O(inst165_cs_o), .OUT(inst7_out));
  EEPROM_1bit inst201 (.CS(inst200_cs_o), .IN(1'b0), .CS_O(inst201_cs_o), .OUT(inst7_out));
  EEPROM_1bit inst237 (.CS(inst236_cs_o), .IN(1'b1), .CS_O(inst237_cs_o), .OUT(inst7_out));
  EEPROM_1bit inst273 (.CS(inst272_cs_o), .IN(1'b0), .CS_O(inst273_cs_o), .OUT(inst7_out));
  EEPROM_1bit inst308 (.CS(inst307_cs_o), .IN(1'b0), .CS_O(inst308_cs_o), .OUT(inst7_out));
  EEPROM_1bit inst343 (.CS(inst342_cs_o), .IN(1'b0), .CS_O(inst343_cs_o), .OUT(inst7_out));
  EEPROM_1bit inst377 (.CS(inst376_cs_o), .IN(1'b0), .CS_O(inst377_cs_o), .OUT(inst7_out));
  EEPROM_1bit inst413 (.CS(inst412_cs_o), .IN(1'b0), .CS_O(inst413_cs_o), .OUT(inst7_out));
  EEPROM_1bit inst449 (.CS(inst448_cs_o), .IN(1'b0), .CS_O(inst449_cs_o), .OUT(inst7_out));
  EEPROM_1bit inst485 (.CS(inst484_cs_o), .IN(1'b0), .CS_O(inst485_cs_o), .OUT(inst7_out));
  EEPROM_1bit inst521 (.CS(inst520_cs_o), .IN(1'b0), .CS_O(inst521_cs_o), .OUT(inst7_out));
  EEPROM_1bit inst557 (.CS(inst556_cs_o), .IN(1'b1), .CS_O(inst557_cs_o), .OUT(inst7_out));
  EEPROM_1bit inst592 (.CS(inst591_cs_o), .IN(1'b0), .CS_O(inst592_cs_o), .OUT(inst7_out));
  EEPROM_1bit inst627 (.CS(inst626_cs_o), .IN(1'b0), .CS_O(inst627_cs_o), .OUT(inst7_out));
  EEPROM_1bit inst661 (.CS(inst660_cs_o), .IN(1'b1), .CS_O(inst661_cs_o), .OUT(inst7_out));
  EEPROM_1bit inst697 (.CS(inst696_cs_o), .IN(1'b0), .CS_O(inst697_cs_o), .OUT(inst7_out));
  EEPROM_1bit inst733 (.CS(inst732_cs_o), .IN(1'b0), .CS_O(inst733_cs_o), .OUT(inst7_out));
  EEPROM_1bit inst769 (.CS(inst768_cs_o), .IN(1'b1), .CS_O(inst769_cs_o), .OUT(inst7_out));
  EEPROM_1bit inst805 (.CS(inst804_cs_o), .IN(1'b0), .CS_O(inst805_cs_o), .OUT(inst7_out));
  EEPROM_1bit inst841 (.CS(inst840_cs_o), .IN(1'b0), .CS_O(inst841_cs_o), .OUT(inst7_out));
  EEPROM_1bit inst876 (.CS(inst875_cs_o), .IN(1'b1), .CS_O(inst876_cs_o), .OUT(inst7_out));
  EEPROM_1bit inst911 (.CS(inst910_cs_o), .IN(1'b0), .CS_O(inst911_cs_o), .OUT(inst7_out));
  EEPROM_1bit inst945 (.CS(inst944_cs_o), .IN(1'b0), .CS_O(inst945_cs_o), .OUT(inst7_out));
  EEPROM_1bit inst981 (.CS(inst980_cs_o), .IN(1'b1), .CS_O(inst981_cs_o), .OUT(inst7_out));
  EEPROM_1bit inst1017 (.CS(inst1016_cs_o), .IN(1'b0), .CS_O(inst1017_cs_o), .OUT(inst7_out));
  EEPROM_1bit inst1053 (.CS(inst1052_cs_o), .IN(1'b0), .CS_O(inst1053_cs_o), .OUT(inst7_out));
  EEPROM_1bit inst1089 (.CS(inst1088_cs_o), .IN(1'b0), .CS_O(inst1089_cs_o), .OUT(inst7_out));
  EEPROM_1bit inst1125 (.CS(inst1124_cs_o), .IN(1'b0), .CS_O(inst1125_cs_o), .OUT(inst7_out));
  EEPROM_1bit inst1160 (.CS(inst1159_cs_o), .IN(1'b0), .CS_O(inst1160_cs_o), .OUT(inst7_out));
  EEPROM_1bit inst1195 (.CS(inst1194_cs_o), .IN(1'b0), .CS_O(inst1195_cs_o), .OUT(inst7_out));
  EEPROM_1bit inst1229 (.CS(inst1228_cs_o), .IN(1'b0), .CS_O(inst1229_cs_o), .OUT(inst7_out));
  EEPROM_1bit inst1265 (.CS(inst1264_cs_o), .IN(1'b0), .CS_O(inst1265_cs_o), .OUT(inst7_out));
  EEPROM_1bit inst1301 (.CS(inst1300_cs_o), .IN(1'b0), .CS_O(inst1301_cs_o), .OUT(inst7_out));
  EEPROM_1bit inst1337 (.CS(inst1336_cs_o), .IN(1'b0), .CS_O(inst1337_cs_o), .OUT(inst7_out));
  EEPROM_1bit inst1373 (.CS(inst1372_cs_o), .IN(1'b0), .CS_O(inst1373_cs_o), .OUT(inst7_out));
  EEPROM_1bit inst1409 (.CS(inst1408_cs_o), .IN(1'b0), .CS_O(inst1409_cs_o), .OUT(inst7_out));
  EEPROM_1bit inst1444 (.CS(inst1443_cs_o), .IN(1'b0), .CS_O(inst1444_cs_o), .OUT(inst7_out));
  EEPROM_1bit inst1479 (.CS(inst1478_cs_o), .IN(1'b0), .CS_O(inst1479_cs_o), .OUT(inst7_out));
  EEPROM_1bit inst1513 (.CS(inst1512_cs_o), .IN(1'b0), .CS_O(inst1513_cs_o), .OUT(inst7_out));
  EEPROM_1bit inst1549 (.CS(inst1548_cs_o), .IN(1'b0), .CS_O(inst1549_cs_o), .OUT(inst7_out));
  EEPROM_1bit inst1585 (.CS(inst1584_cs_o), .IN(1'b0), .CS_O(inst1585_cs_o), .OUT(inst7_out));
  EEPROM_1bit inst1621 (.CS(inst1620_cs_o), .IN(1'b0), .CS_O(inst1621_cs_o), .OUT(inst7_out));
  EEPROM_1bit inst1657 (.CS(inst1656_cs_o), .IN(1'b0), .CS_O(inst1657_cs_o), .OUT(inst7_out));
  EEPROM_1bit inst1693 (.CS(inst1692_cs_o), .IN(1'b0), .CS_O(inst1693_cs_o), .OUT(inst7_out));
  EEPROM_1bit inst1728 (.CS(inst1727_cs_o), .IN(1'b0), .CS_O(inst1728_cs_o), .OUT(inst7_out));
  EEPROM_1bit inst1763 (.CS(inst1762_cs_o), .IN(1'b0), .CS_O(inst1763_cs_o), .OUT(inst7_out));
  EEPROM_1bit inst1797 (.CS(inst1796_cs_o), .IN(1'b0), .CS_O(inst1797_cs_o), .OUT(inst7_out));
